# EAGLE design armachat (EAGLE 7.6.0)
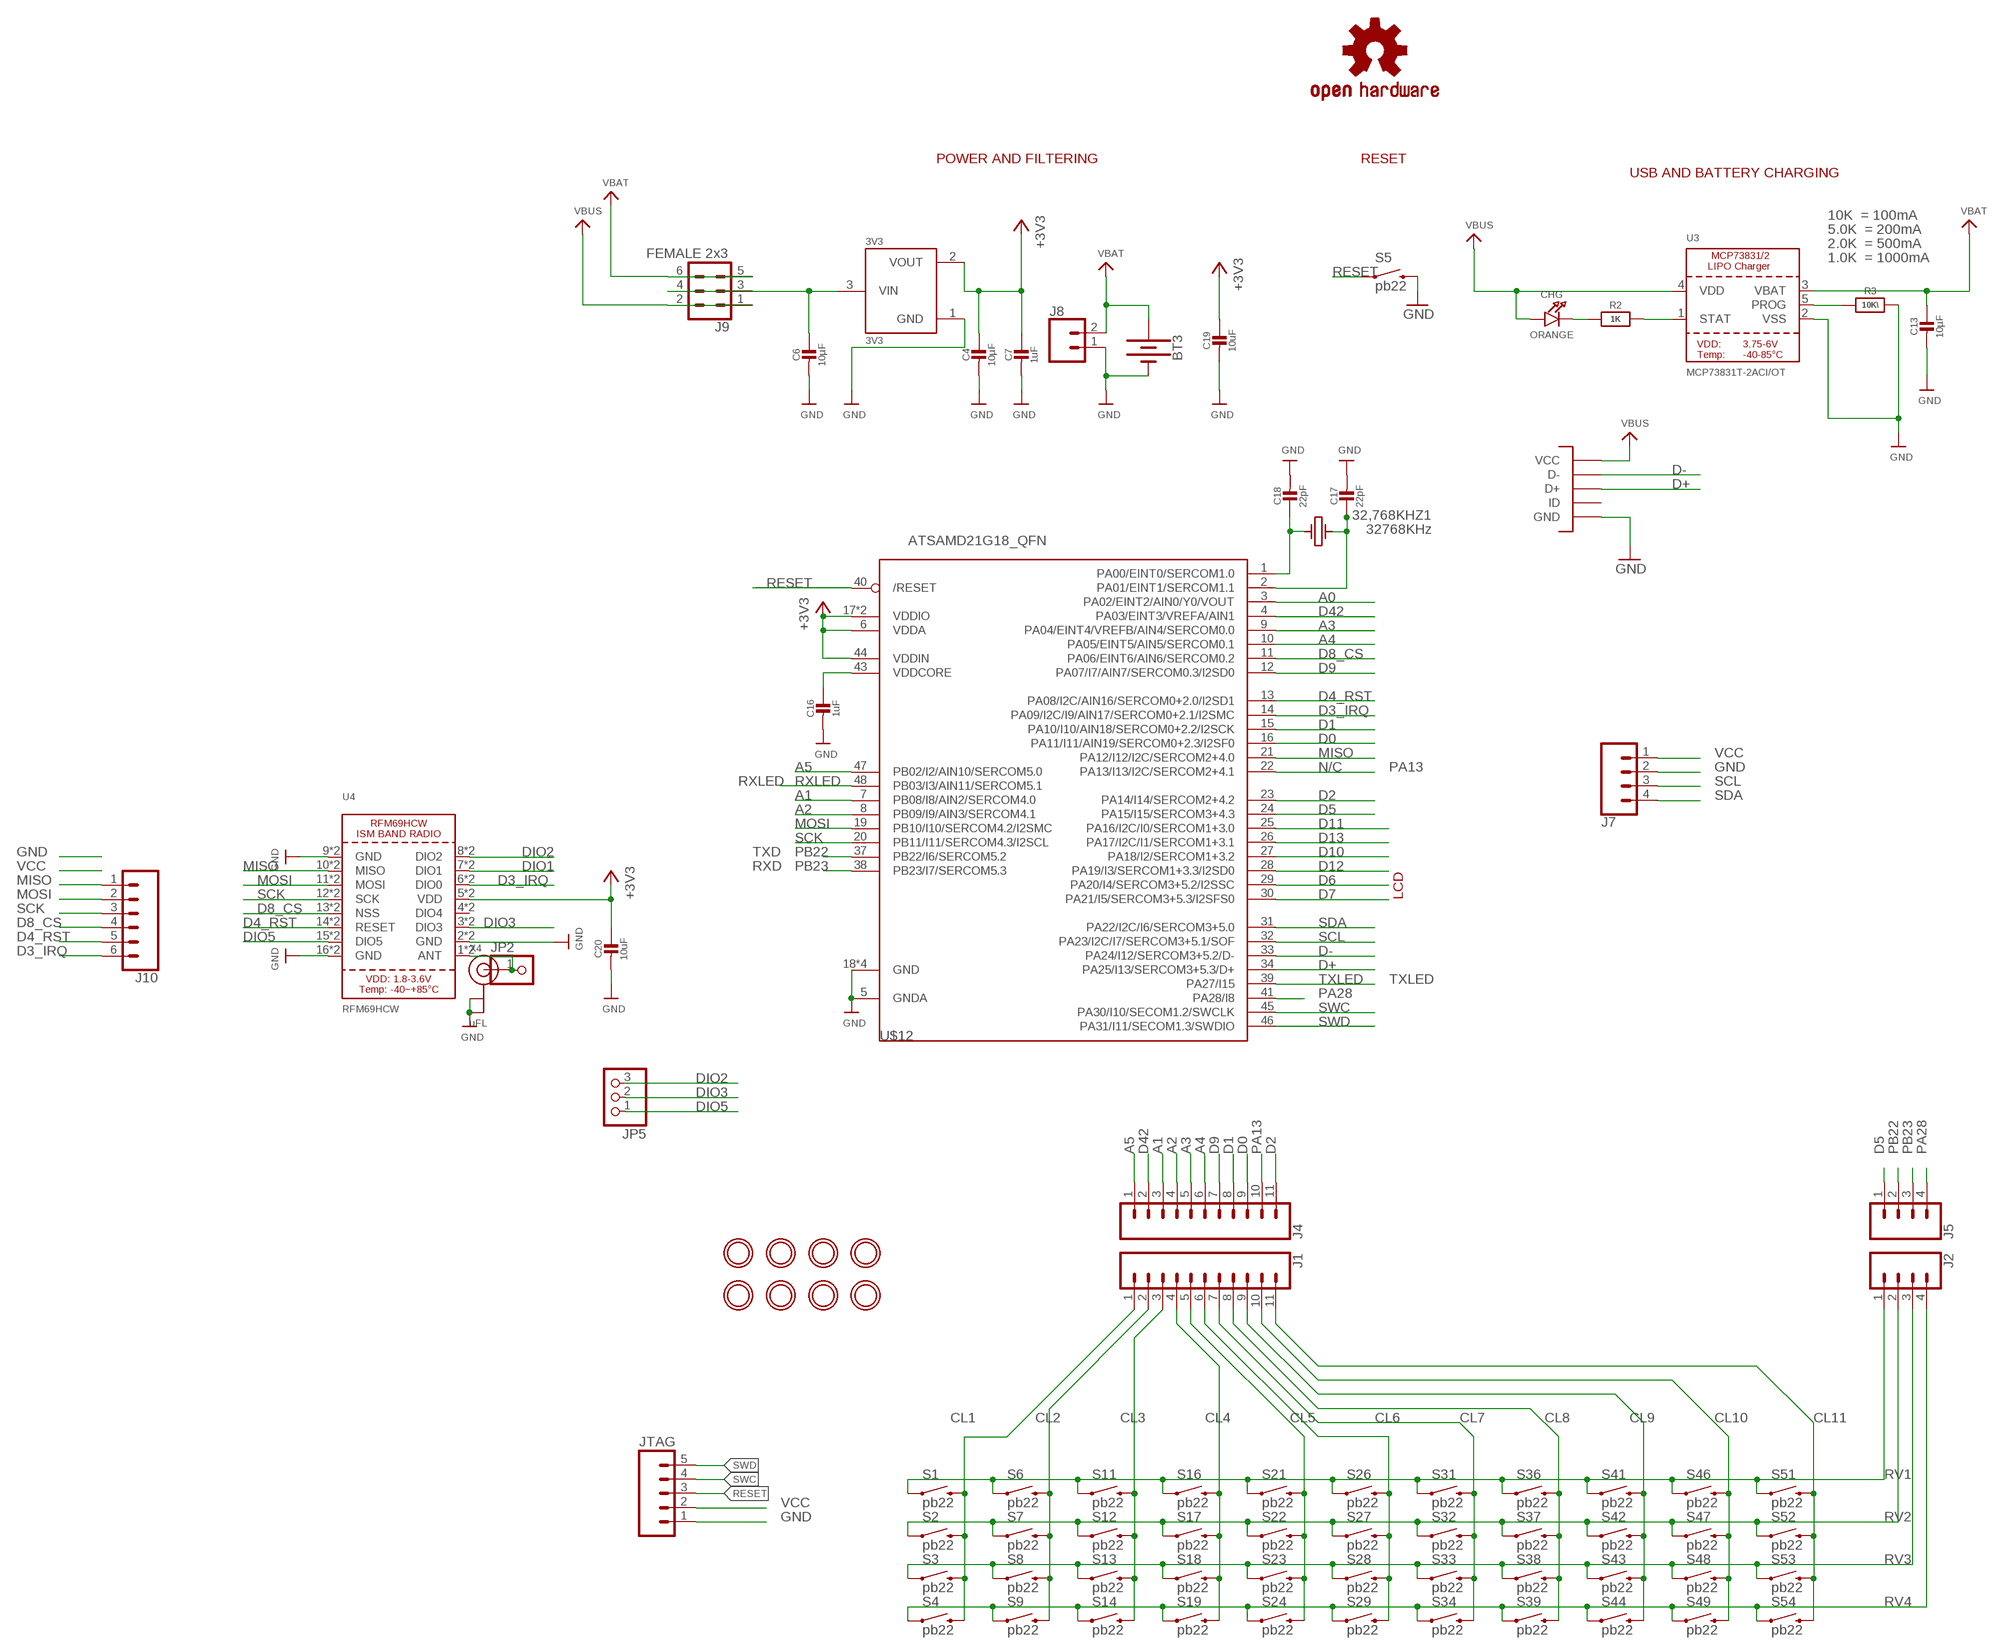
[diagram p0: schematic, sheet 1, part 1 of 2]
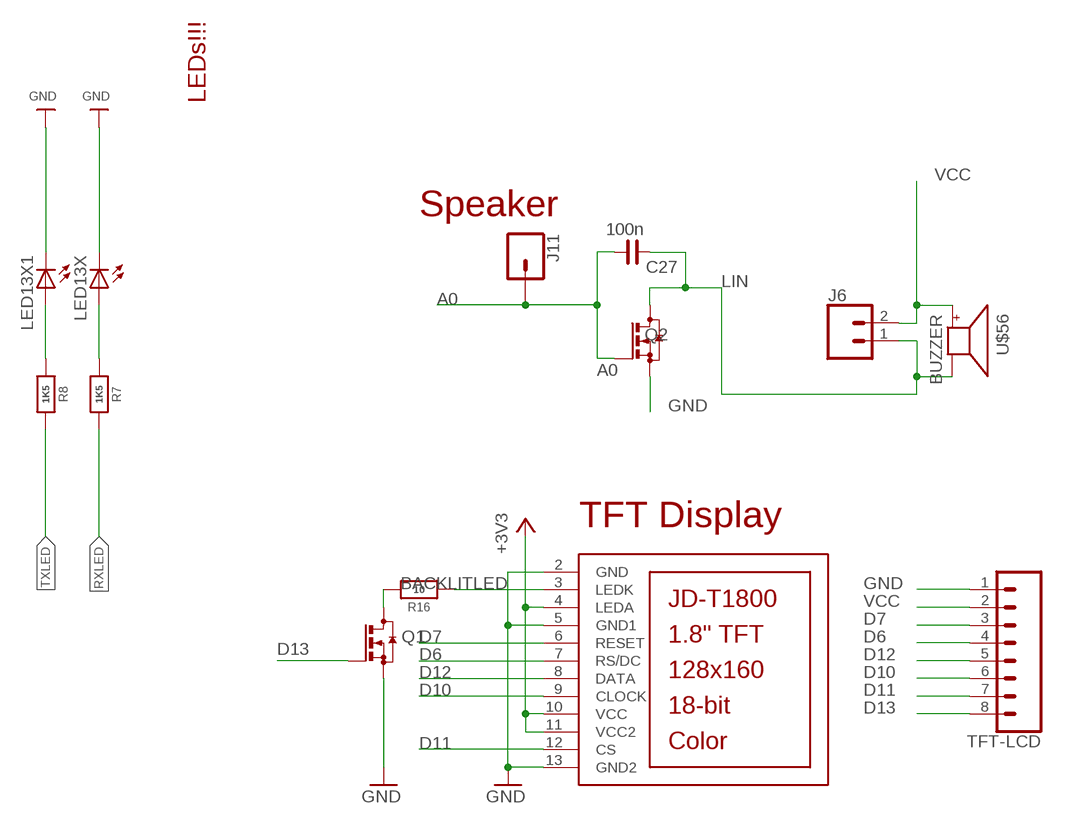
[diagram p1: schematic, sheet 1, part 2 of 2]

## Parts
3V3  3V3  MCP1700T  [SOT23]
32,768KHZ1  32768KHz  CRYSTALL  [KX-327LT]
BT3  BATTERY  [18650_HOLDER_SINGLE_THROUGH-HOLE]
C4  10µF  CAP_CERAMIC0805-NOOUTLINE  [0805-NO]
C6  10µF  CAP_CERAMIC0805-NOOUTLINE  [0805-NO]
C7  1uF  CAP_CERAMIC0603_NO  [0603-NO]
C13  10µF  CAP_CERAMIC0805-NOOUTLINE  [0805-NO]
C16  1uF  CAP_CERAMIC0603_NO  [0603-NO]
C17  22pF  CAP_CERAMIC0603_NO  [0603-NO]
C18  22pF  CAP_CERAMIC0603_NO  [0603-NO]
C19  10uF  CAP_CERAMIC0603_NO  [0603-NO]
C20  10uF  CAP_CERAMIC0805-NOOUTLINE  [0805-NO]
C27  100n  C_0603  [C0603]
CHG  ORANGE  LED0805_NOOUTLINE  [CHIPLED_0805_NOOUTLINE]
J1  CONN_111X11_NO_SILK  [1X11_NO_SILK]
J2  CONN_041X04_NO_SILK  [1X04_NO_SILK]
J4  CONN_111X11_NO_SILK  [1X11_NO_SILK]
J5  CONN_041X04_NO_SILK  [1X04_NO_SILK]
J6  CONN_021X02_NO_SILK  [1X02_NO_SILK]
J7  CONN_041X04_NO_SILK  [1X04_NO_SILK]
J8  CONN_021X02_NO_SILK  [1X02_NO_SILK]
J9  FEMALE 2x3  CONN_03X2FEMALE  [2X3]
J10  CONN_06NO_SILK_FEMALE_PTH  [1X06_NO_SILK]
J11  CONN_01  [1X01]
JP2  HEADER-1X1ROUND  [1X01_ROUND]
JP5  HEADER-1X3ROUND  [1X03_ROUND]
JTAG  M051.27MM  [1X05-1.27MM]
LCD1  DISP_LCD_JDT1800  [JD-T1800]
LED13X  LED3MM  [LED3MM]
LED13X1  LED3MM  [LED3MM]
LOGO3  OSHW-LOGOS  [OSHW-LOGO-S]
Q1  BSS123  [SOT23]
Q2  BSS123  [SOT23]
R2  1K  RESISTOR_0603_NOOUT  [0603-NO]
R3  10K\  RESISTOR_0603_NOOUT  [0603-NO]
R7  1K5  RESISTOR_0603MP  [_0603MP]
R8  1K5  RESISTOR_0603MP  [_0603MP]
R16  10  RESISTOR_0603_NOOUT  [0603-NO]
S1  pb22  SWITCH-MOMENTARY-2PTH  [TACTILE-PTH]
S2  pb22  SWITCH-MOMENTARY-2PTH  [TACTILE-PTH]
S3  pb22  SWITCH-MOMENTARY-2PTH  [TACTILE-PTH]
S4  pb22  SWITCH-MOMENTARY-2PTH  [TACTILE-PTH]
S5  pb22  SWITCH-MOMENTARY-2SMD-1101NE  [TACTILE-SWITCH-1101NE]
S6  pb22  SWITCH-MOMENTARY-2PTH  [TACTILE-PTH]
S7  pb22  SWITCH-MOMENTARY-2PTH  [TACTILE-PTH]
S8  pb22  SWITCH-MOMENTARY-2PTH  [TACTILE-PTH]
S9  pb22  SWITCH-MOMENTARY-2PTH  [TACTILE-PTH]
S11  pb22  SWITCH-MOMENTARY-2PTH  [TACTILE-PTH]
S12  pb22  SWITCH-MOMENTARY-2PTH  [TACTILE-PTH]
S13  pb22  SWITCH-MOMENTARY-2PTH  [TACTILE-PTH]
S14  pb22  SWITCH-MOMENTARY-2PTH  [TACTILE-PTH]
S16  pb22  SWITCH-MOMENTARY-2PTH  [TACTILE-PTH]
S17  pb22  SWITCH-MOMENTARY-2PTH  [TACTILE-PTH]
S18  pb22  SWITCH-MOMENTARY-2PTH  [TACTILE-PTH]
S19  pb22  SWITCH-MOMENTARY-2PTH  [TACTILE-PTH]
S21  pb22  SWITCH-MOMENTARY-2PTH  [TACTILE-PTH]
S22  pb22  SWITCH-MOMENTARY-2PTH  [TACTILE-PTH]
S23  pb22  SWITCH-MOMENTARY-2PTH  [TACTILE-PTH]
S24  pb22  SWITCH-MOMENTARY-2PTH  [TACTILE-PTH]
S26  pb22  SWITCH-MOMENTARY-2PTH  [TACTILE-PTH]
S27  pb22  SWITCH-MOMENTARY-2PTH  [TACTILE-PTH]
S28  pb22  SWITCH-MOMENTARY-2PTH  [TACTILE-PTH]
S29  pb22  SWITCH-MOMENTARY-2PTH  [TACTILE-PTH]
S31  pb22  SWITCH-MOMENTARY-2PTH  [TACTILE-PTH]
S32  pb22  SWITCH-MOMENTARY-2PTH  [TACTILE-PTH]
S33  pb22  SWITCH-MOMENTARY-2PTH  [TACTILE-PTH]
S34  pb22  SWITCH-MOMENTARY-2PTH  [TACTILE-PTH]
S36  pb22  SWITCH-MOMENTARY-2PTH  [TACTILE-PTH]
S37  pb22  SWITCH-MOMENTARY-2PTH  [TACTILE-PTH]
S38  pb22  SWITCH-MOMENTARY-2PTH  [TACTILE-PTH]
S39  pb22  SWITCH-MOMENTARY-2PTH  [TACTILE-PTH]
S41  pb22  SWITCH-MOMENTARY-2PTH  [TACTILE-PTH]
S42  pb22  SWITCH-MOMENTARY-2PTH  [TACTILE-PTH]
S43  pb22  SWITCH-MOMENTARY-2PTH  [TACTILE-PTH]
S44  pb22  SWITCH-MOMENTARY-2PTH  [TACTILE-PTH]
S46  pb22  SWITCH-MOMENTARY-2PTH  [TACTILE-PTH]
S47  pb22  SWITCH-MOMENTARY-2PTH  [TACTILE-PTH]
S48  pb22  SWITCH-MOMENTARY-2PTH  [TACTILE-PTH]
S49  pb22  SWITCH-MOMENTARY-2PTH  [TACTILE-PTH]
S51  pb22  SWITCH-MOMENTARY-2PTH  [TACTILE-PTH]
S52  pb22  SWITCH-MOMENTARY-2PTH  [TACTILE-PTH]
S53  pb22  SWITCH-MOMENTARY-2PTH  [TACTILE-PTH]
S54  pb22  SWITCH-MOMENTARY-2PTH  [TACTILE-PTH]
TFT-LCD  CONN_08"  [1X08]
U3  MCP73831T-2ACI/OT  MCP73831/2  [SOT23-5]
U4  RFM69HCW  [RFM69HCW]
U$2  MOUNTINGHOLE2.0  [MOUNTINGHOLE_2.0_PLATED]
U$3  MOUNTINGHOLE2.0  [MOUNTINGHOLE_2.0_PLATED]
U$4  MOUNTINGHOLE2.0  [MOUNTINGHOLE_2.0_PLATED]
U$5  MICROUSB  [MICRO_B]
U$10  MOUNTINGHOLE2.0  [MOUNTINGHOLE_2.0_PLATED]
U$11  MOUNTINGHOLE2.0  [MOUNTINGHOLE_2.0_PLATED]
U$12  ATSAMD21G18_QFN  ATSAMD21J_QFN  [TQFN48_7MM]
U$19  MOUNTINGHOLE2.0  [MOUNTINGHOLE_2.0_PLATED]
U$20  MOUNTINGHOLE2.0  [MOUNTINGHOLE_2.0_PLATED]
U$42  MOUNTINGHOLE2.0  [MOUNTINGHOLE_2.0_PLATED]
U$56  BUZZER  [SMT-8585-BUZZER]
X4  uFL  ANTENNA_U.FL  [U.FL]

## Nets
A0: C27.1 J11.1 Q2.1(G) U$12.3(PA02/EINT2/AIN0/Y0/VOUT)
A1: J4.3 U$12.7(PB08/I8/AIN2/SERCOM4.0)
A2: J4.4 U$12.8(PB09/I9/AIN3/SERCOM4.1)
A3: J4.5 U$12.9(PA04/EINT4/VREFB/AIN4/SERCOM0.0)
A4: J4.6 U$12.10(PA05/EINT5/AIN5/SERCOM0.1)
A5: J4.1 U$12.47(PB02/I2/AIN10/SERCOM5.0)
ANT: JP2.1 U4.1(ANT) U4.1P(ANT) X4.3(SIGNAL)
BACKLITLED: LCD1.3(LEDK) R16.1
CL1: J1.1 S1.3 S2.3 S3.3 S4.3
CL2: J1.2 S6.3 S7.3 S8.3 S9.3
CL3: J1.3 S11.3 S12.3 S13.3 S14.3
CL4: J1.4 S16.3 S17.3 S18.3 S19.3
CL5: J1.5 S21.3 S22.3 S23.3 S24.3
CL6: J1.6 S26.3 S27.3 S28.3 S29.3
CL7: J1.7 S31.3 S32.3 S33.3 S34.3
CL8: J1.8 S36.3 S37.3 S38.3 S39.3
CL9: J1.9 S41.3 S42.3 S43.3 S44.3
CL10: J1.10 S46.3 S47.3 S48.3 S49.3
CL11: J1.11 S51.3 S52.3 S53.3 S54.3
D0: J4.9 U$12.16(PA11/I11/AIN19/SERCOM0+2.3/I2SF0)
D1: J4.8 U$12.15(PA10/I10/AIN18/SERCOM0+2.2/I2SCK)
D2: J4.11 U$12.23(PA14/I14/SERCOM2+4.2)
D3_IRQ: J10.6 U4.6(DIO0) U4.6P(DIO0) U$12.14(PA09/I2C/I9/AIN17/SERCOM0+2.1/I2SMC)
D4_RST: J10.5 U4.14(RESET) U4.14P(RESET) U$12.13(PA08/I2C/AIN16/SERCOM0+2.0/I2SD1)
D5: J5.1 U$12.24(PA15/I15/SERCOM3+4.3)
D6: LCD1.7(RS/DC) TFT-LCD.4 U$12.29(PA20/I4/SERCOM3+5.2/I2SSC)
D7: LCD1.6(RESET) TFT-LCD.3 U$12.30(PA21/I5/SERCOM3+5.3/I2SFS0)
D8_CS: J10.4 U4.13(NSS) U4.13P(NSS) U$12.11(PA06/EINT6/AIN6/SERCOM0.2)
D9: J4.7 U$12.12(PA07/I7/AIN7/SERCOM0.3/I2SD0)
D10: LCD1.9(CLOCK) TFT-LCD.6 U$12.27(PA18/I2/SERCOM1+3.2)
D11: LCD1.12(CS) TFT-LCD.7 U$12.25(PA16/I2C/I0/SERCOM1+3.0)
D12: LCD1.8(DATA) TFT-LCD.5 U$12.28(PA19/I3/SERCOM1+3.3/I2SD0)
D13: Q1.1(G) TFT-LCD.8 U$12.26(PA17/I2C/I1/SERCOM1+3.1)
D42: J4.2 U$12.4(PA03/EINT3/VREFA/AIN1)
D+: U$5.P3(D+) U$12.34(PA25/I13/SERCOM3+5.3/D+)
D-: U$5.P2(D-) U$12.33(PA24/I12/SERCOM3+5.2/D-)
DIO1: U4.7(DIO1) U4.7P(DIO1)
DIO2: JP5.3 U4.8(DIO2) U4.8P(DIO2)
DIO3: JP5.2 U4.3(DIO3) U4.3P(DIO3)
DIO5: JP5.1 U4.15(DIO5) U4.15P(DIO5)
GND [gnd]: 3V3.1(GND) BT3.CON(-)(-) C4.2 C6.2 C7.2 C13.2 C16.2 C17.2 C18.2 C19.2 C20.2 J7.2 J8.1 JTAG.1 LCD1.2(GND) LCD1.5(GND1) LCD1.13(GND2) LED13X1.K(C) LED13X.K(C) Q1.2(S) Q2.2(S) R3.2 S5.2 TFT-LCD.1 U3.2(VSS) U4.2(GND) U4.2P(GND) U4.9(GND) U4.9P(GND) U4.16(GND) U4.16P(GND) U$5.GND1(GND) U$5.GND2(GND) U$5.GND3(GND) U$5.GND4(GND) U$5.GND7(GND) U$5.GND8(GND) U$5.P5(GND) U$12.5(GNDA) U$12.18(GND) U$12.35(GND) U$12.42(GND) U$12.THERMAL(GND) X4.1(GND) X4.2(GND)
LIN: C27.2 J6.1 Q2.3(D) U$56.-
MISO: J10.1 U4.10(MISO) U4.10P(MISO) U$12.21(PA12/I12/I2C/SERCOM2+4.0)
MOSI: J10.2 U4.11(MOSI) U4.11P(MOSI) U$12.19(PB10/I10/SERCOM4.2/I2SMC)
N$1: 3V3.3(VIN) C6.1 J9.3 J9.4
N$3: CHG.C R2.1
N$5: R2.2 U3.1(STAT)
N$6: R3.1 U3.5(PROG)
N$7: LED13X1.A R8.2
N$8: 32,768KHZ1.4 C17.1 U$12.2(PA01/EINT1/SERCOM1.1)
N$9: 32,768KHZ1.1 C18.1 U$12.1(PA00/EINT0/SERCOM1.0)
N$11: Q1.3(D) R16.2
N$22: LED13X.A R7.2
PA13: J4.10 U$12.22(PA13/I13/I2C/SERCOM2+4.1)
PA28: J5.4 U$12.41(PA28/I8)
PB22: J5.2 U$12.37(PB22/I6/SERCOM5.2)
PB23: J5.3 U$12.38(PB23/I7/SERCOM5.3)
RESET: JTAG.3 S5.1 U$12.40(/RESET)
RV1: J2.1 S1.1 S6.1 S11.1 S16.1 S21.1 S26.1 S31.1 S36.1 S41.1 S46.1 S51.1
RV2: J2.2 S2.1 S7.1 S12.1 S17.1 S22.1 S27.1 S32.1 S37.1 S42.1 S47.1 S52.1
RV3: J2.3 S3.1 S8.1 S13.1 S18.1 S23.1 S28.1 S33.1 S38.1 S43.1 S48.1 S53.1
RV4: J2.4 S4.1 S9.1 S14.1 S19.1 S24.1 S29.1 S34.1 S39.1 S44.1 S49.1 S54.1
RXLED: R7.1 U$12.48(PB03/I3/AIN11/SERCOM5.1)
SCK: J10.3 U4.12(SCK) U4.12P(SCK) U$12.20(PB11/I11/SERCOM4.3/I2SCL)
SCL: J7.3 U$12.32(PA23/I2C/I7/SERCOM3+5.1/SOF)
SDA: J7.4 U$12.31(PA22/I2C/I6/SERCOM3+5.0)
SWC: JTAG.4 U$12.45(PA30/I10/SECOM1.2/SWCLK)
SWD: JTAG.5 U$12.46(PA31/I11/SECOM1.3/SWDIO)
TXLED: R8.1 U$12.39(PA27/I15)
VBAT: BT3.CON(+)(+) C13.1 J8.2 J9.5 J9.6 U3.3(VBAT)
VBUS: CHG.A J9.1 J9.2 U3.4(VDD) U$5.P1(VCC)
VCC [vcc]: 3V3.2(VOUT) C4.1 C7.1 C19.1 C20.1 J6.2 J7.1 JTAG.2 LCD1.4(LEDA) LCD1.10(VCC) LCD1.11(VCC2) TFT-LCD.2 U4.5(VDD) U4.5P(VDD) U$12.6(VDDA) U$12.17(VDDIO) U$12.36(VDDIO) U$12.44(VDDIN) U$56.+ ; supply symbol labelled +3V3
VDDCORE1: C16.1 U$12.43(VDDCORE)
Unconnected: U4.4(DIO4) U4.4P(DIO4) U$5.P4(ID)

## Notes on the sheet
- POWER AND FILTERING | RESET
- USB AND BATTERY CHARGING
- 10K  = 100mA
- 5.0K  = 200mA
- 2.0K  = 500mA
- 1.0K  = 1000mA
- LEDs!!!
- Speaker
- N/C
- RXLED
- TXD
- RXD
- LCD
- TFT Display
- TXLED

## Library data of the parts
3V3 = okie:MCP1700T
32,768KHZ1 = es:CRYSTALL
BT3 = Batteries:BATTERY: Battery - Single Cell A variety of battery chemistries, sizes, and footprints. Device List: 20MM_PTH - Coin Cell Battery Holder - 20mm (PTH) <https://www.sparkfun.com/products/783> 12MM_SMD - Coin Cell Battery Holder - 12mm (SMD) <https://www.sparkfun.com/products/10592> 12MM_PTH - Coin Cell Battery Holder - 12mm (PTH) <https://www.sparkfun.com/products/7948> 20MM_SMD - 20mm Coin Cell Battery Holder (SMD) (2 legs) Used on the Big Time Watch Kit <https://www.sparkfun.com/products/11734> 20MM_SMD_4LEGS - Coin Cell Battery Holder - 20mm (SMD) <https://www.sparkfun.com/products/11892> 20MM_SMD_4LEGS_OVERPASTE - Coin Cell Battery Holder - 20mm (SMD) <https://www.sparkfun.com/products/11892> (Over-paste on the legs) 24.5MM_PTH - Coin Cell Battery Holder - 24.5mm (PTH) <https://www.sparkfun.com/products/8863> 9V - 9V Battery Holder - PC Mount Used on the SparkFun SparkPunk Sound Kit <https://www.sparkfun.com/products/11177> and SparkFun SparkPunk Sequencer Kit <https://www.sparkfun.com/products/12707> 18650 - Battery Holder - 18650 (PTH) <https://www.sparkfun.com/products/13113> AA - Battery Holder - 1xAA (PTH) <https://www.sparkfun.com/products/7949> AAA - Battery Holder - 1xAAA (PTH) <https://www.sparkfun.com/products/12718> AA_KIT - Battery Holder - 1xAA (PTH) <https://www.sparkfun.com/products/7949> Special kit package - pads only have exposed copper on one side of the board. AAA_KIT - Battery Holder - 1xAAA (PTH) <https://www.sparkfun.com/products/12718> Special kit package - pads only have exposed copper on one side of the board.
C4 C6 C7 C13 C16-C20 = microbuilder:CAP_CERAMIC: Ceramic Capacitors For new designs, use the packages preceded by an '_' character since they are more reliable: The following footprints should be used on most boards: _0402 - Standard footprint for regular board layouts _0603 - Standard footprint for regular board layouts _0805 - Standard footprint for regular board layouts _1206 - Standard footprint for regular board layouts For extremely tight-pitch boards where space is at a premium, the following 'micro-pitch' footprints can be used (smaller pads, no silkscreen outline, etc.): _0402MP - Micro-pitch footprint for very dense/compact boards _0603MP - Micro-pitch footprint for very dense/compact boards _0805MP - Micro-pitch footprint for very dense/compact boards _1206MP - Micro-pitch footprint for very dense/compact boards
C27 = rc-master-smd:C_: NON-POLARIZED CAP
CHG = microbuilder:LED: LED
J1 J4 = SparkFun-Connectors:CONN_11: Multi connection point. Often used as Generic Header-pin footprint for 0.1 inch spaced/style header connections On any of the 0.1 inch spaced packages, you can populate with these: Break Away Headers - Straight <https://www.sparkfun.com/products/116> (PRT-00116) Break Away Male Headers - Right Angle <https://www.sparkfun.com/products/553> (PRT-00553) Female Headers <https://www.sparkfun.com/products/115> (PRT-00115) Break Away Headers - Machine Pin <https://www.sparkfun.com/products/117> (PRT-00117) Break Away Female Headers - Swiss Machine Pin <https://www.sparkfun.com/products/743> (PRT-00743) For SCREWTERMINALS and SPRING TERMINALS visit here: Screw Terimnals on SparkFun.com <https://www.sparkfun.com/search/results?term=Screw+Terminals> (5mm/3.5mm/2.54mm spacing) This device is also useful as a general connection point to wire up your design to another part of your project. Our various solder wires solder well into these plated through hole pads. Hook-Up Wire - Assortment (Stranded, 22 AWG) <https://www.sparkfun.com/products/11375> (PRT-11375) Hook-Up Wire - Assortment (Solid Core, 22 AWG) <https://www.sparkfun.com/products/11367> (PRT-11367) View the entire wire category on our website here <https://www.sparkfun.com/categories/141>
J2 J5 J7 = SparkFun-Connectors:CONN_04: Multi connection point. Often used as Generic Header-pin footprint for 0.1 inch spaced/style header connections On any of the 0.1 inch spaced packages, you can populate with these: Break Away Headers - Straight <https://www.sparkfun.com/products/116> (PRT-00116) Break Away Male Headers - Right Angle <https://www.sparkfun.com/products/553> (PRT-00553) Female Headers <https://www.sparkfun.com/products/115> (PRT-00115) Break Away Headers - Machine Pin <https://www.sparkfun.com/products/117> (PRT-00117) Break Away Female Headers - Swiss Machine Pin <https://www.sparkfun.com/products/743> (PRT-00743) For SCREWTERMINALS and SPRING TERMINALS visit here: Screw Terimnals on SparkFun.com <https://www.sparkfun.com/search/results?term=Screw+Terminals> (5mm/3.5mm/2.54mm spacing) This device is also useful as a general connection point to wire up your design to another part of your project. Our various solder wires solder well into these plated through hole pads. Hook-Up Wire - Assortment (Stranded, 22 AWG) <https://www.sparkfun.com/products/11375> (PRT-11375) Hook-Up Wire - Assortment (Solid Core, 22 AWG) <https://www.sparkfun.com/products/11367> (PRT-11367) View the entire wire category on our website here <https://www.sparkfun.com/categories/141> Special notes: Molex polarized connector foot print use with SKU : PRT-08231 with associated crimp pins and housings. 1MM SMD Version SKU: PRT-10208; PROD_ID: CONN-09696
J6 J8 = SparkFun-Connectors:CONN_02: Multi connection point. Often used as Generic Header-pin footprint for 0.1 inch spaced/style header connections On any of the 0.1 inch spaced packages, you can populate with these: Break Away Headers - Straight <https://www.sparkfun.com/products/116> (PRT-00116) Break Away Male Headers - Right Angle <https://www.sparkfun.com/products/553> (PRT-00553) Female Headers <https://www.sparkfun.com/products/115> (PRT-00115) Break Away Headers - Machine Pin <https://www.sparkfun.com/products/117> (PRT-00117) Break Away Female Headers - Swiss Machine Pin <https://www.sparkfun.com/products/743> (PRT-00743) For SCREWTERMINALS and SPRING TERMINALS visit here: Screw Terimnals on SparkFun.com <https://www.sparkfun.com/search/results?term=Screw+Terminals> (5mm/3.5mm/2.54mm spacing) This device is also useful as a general connection point to wire up your design to another part of your project. Our various solder wires solder well into these plated through hole pads. Hook-Up Wire - Assortment (Stranded, 22 AWG) <https://www.sparkfun.com/products/11375> (PRT-11375) Hook-Up Wire - Assortment (Solid Core, 22 AWG) <https://www.sparkfun.com/products/11367> (PRT-11367) View the entire wire category on our website here <https://www.sparkfun.com/categories/141> Special notes: Molex polarized connector foot print use with: PRT-08233 with associated crimp pins and housings. 2.54_SCREWTERM for use with PRT-10571. 3.5mm Screw Terminal footprints for PRT-08084 5mm Screw Terminal footprints for use with PRT-08432
J9 = SparkFun-Connectors:CONN_03X2: Multi connection point. Often used as Generic Header-pin footprint for 0.1 inch spaced/style header connections You can populate with any combo of single row headers, but if you'd like an exact match, check these: Header - 2x3 (Male, 0.1") <https://www.sparkfun.com/products/12807> (PRT-12807) Header - 2x3 (Female, 0.1") <https://www.sparkfun.com/products/13010> (PRT-13010) 2x3 Pin Shrouded Header <https://www.sparkfun.com/products/10877> (PRT-10877) On any of the 0.1 inch spaced packages, you can populate with these: Break Away Headers - Straight <https://www.sparkfun.com/products/116> (PRT-00116) Break Away Male Headers - Right Angle <https://www.sparkfun.com/products/553> (PRT-00553) Female Headers <https://www.sparkfun.com/products/115> (PRT-00115) Break Away Headers - Machine Pin <https://www.sparkfun.com/products/117> (PRT-00117) Break Away Female Headers - Swiss Machine Pin <https://www.sparkfun.com/products/743> (PRT-00743) Special note: the shrouded connector mates well with our 3x2 ribbon cables: Ribbon Crimp Connector - 6-pin (2x3, Female) <https://www.sparkfun.com/products/10651> (PRT-10651) Ribbon Cable - 6 wire (15ft) <https://www.sparkfun.com/products/10646> (PRT-10646); PROD_ID: CONN-11566
J10 = SparkFun-Connectors:CONN_06: Multi connection point. Often used as Generic Header-pin footprint for 0.1 inch spaced/style header connections On any of the 0.1 inch spaced packages, you can populate with these: Break Away Headers - Straight <https://www.sparkfun.com/products/116> (PRT-00116) Break Away Male Headers - Right Angle <https://www.sparkfun.com/products/553> (PRT-00553) Female Headers <https://www.sparkfun.com/products/115> (PRT-00115) Break Away Headers - Machine Pin <https://www.sparkfun.com/products/117> (PRT-00117) Break Away Female Headers - Swiss Machine Pin <https://www.sparkfun.com/products/743> (PRT-00743) Arduino Stackable Header - 6 Pin <https://www.sparkfun.com/products/9280> (PRT-09280) For SCREWTERMINALS and SPRING TERMINALS visit here: Screw Terimnals on SparkFun.com <https://www.sparkfun.com/search/results?term=Screw+Terminals> (5mm/3.5mm/2.54mm spacing) This device is also useful as a general connection point to wire up your design to another part of your project. Our various solder wires solder well into these plated through hole pads. Hook-Up Wire - Assortment (Stranded, 22 AWG) <https://www.sparkfun.com/products/11375> (PRT-11375) Hook-Up Wire - Assortment (Solid Core, 22 AWG) <https://www.sparkfun.com/products/11367> (PRT-11367) View the entire wire category on our website here <https://www.sparkfun.com/categories/141>; PROD_ID: CONN-08437
J11 = SparkFun-Connectors:CONN_01: Single connection point. Often used as Generic Header-pin footprint for 0.1 inch spaced/style header connections On any of the 0.1 inch spaced packages, you can populate with these: Break Away Headers - Straight <https://www.sparkfun.com/products/116> (PRT-00116) Break Away Male Headers - Right Angle <https://www.sparkfun.com/products/553> (PRT-00553) Female Headers <https://www.sparkfun.com/products/115> (PRT-00115) Break Away Headers - Machine Pin <https://www.sparkfun.com/products/117> (PRT-00117) Break Away Female Headers - Swiss Machine Pin <https://www.sparkfun.com/products/743> (PRT-00743) This device is also useful as a general connection point to wire up your design to another part of your project. Our various solder wires solder well into these plated through hole pads. Hook-Up Wire - Assortment (Stranded, 22 AWG) <https://www.sparkfun.com/products/11375> (PRT-11375) Hook-Up Wire - Assortment (Solid Core, 22 AWG) <https://www.sparkfun.com/products/11367> (PRT-11367) View the entire wire category on our website here <https://www.sparkfun.com/categories/141> Special notes: SMTSO-256-ET is a "flush mount" nut for a 4-40 screw. We mostly use this on specialty testbeds; it is a nice way to connect hardware to your PCB at an adjustable hieght. Also note, the SNAP packages are for using a snappable style connector. We sell a baggie of snaps and they are also used on two LilyPad designs: Snap Assortment - 30 pack (male and female) <https://www.sparkfun.com/products/11347> (DEV-11347) LilyPad Arduino SimpleSnap <https://www.sparkfun.com/products/10941> (DEV-10941) LilyPad SimpleSnap Protoboard <https://www.sparkfun.com/products/10940> (DEV-10940)
JP2 = microbuilder:HEADER-1X1: PIN HEADER
JP5 = microbuilder:HEADER-1X3: PIN HEADER
JTAG = SparkFun-Connectors:M05: Header 5 Standard 5-pin 0.1" header. Use with straight break away headers (SKU : PRT-00116), right angle break away headers (PRT-00553), swiss pins (PRT-00743), machine pins (PRT-00117), and female headers (PRT-00115). Molex polarized connector foot print use with SKU : PRT-08230 with associated crimp pins and housings.
LCD1 = microbuilder:DISP_LCD_JDT1800
LED13X LED13X1 = led:LED: LED
LOGO3 = SparkFun-Aesthetics:OSHW-LOGO: Open Source Hardware Logo This logo indicates the piece of hardware it is found on incorporates a OSHW license and/or adheres to the definition of open source hardware found here: http://freedomdefined.org/OSHW
Q1 Q2 = transistor-small-signal:BSS123: N-CHANNEL MOS FET
R2 R3 R7 R8 R16 = microbuilder:RESISTOR: Resistors For new designs, use the packages preceded by an '_' character since they are more reliable: The following footprints should be used on most boards: _0402 - Standard footprint for regular board layouts _0603 - Standard footprint for regular board layouts _0805 - Standard footprint for regular board layouts _1206 - Standard footprint for regular board layouts For extremely tight-pitch boards where space is at a premium, the following 'micro-pitch' footprints can be used (smaller pads, no silkscreen outline, etc.): _0402MP - Micro-pitch footprint for very dense/compact boards _0603MP - Micro-pitch footprint for very dense/compact boards _0805MP - Micro-pitch footprint for very dense/compact boards _1206MP - Micro-pitch footprint for very dense/compact boards
S1-S4 S6-S9 S11-S14 S16-S19 S21-S24 S26-S29 S31-S34 S36-S39 S41-S44 S46-S49 S51-S54 = SparkFun-Electromechanical:SWITCH-MOMENTARY-2: Various NO switches- pushbuttons, reed, etc; PROD_ID: SWCH-08441
S5 = SparkFun-Electromechanical:SWITCH-MOMENTARY-2: Various NO switches- pushbuttons, reed, etc; PROD_ID: SWCH-00815
TFT-LCD = SparkFun-Connectors:CONN_08: Multi connection point. Often used as Generic Header-pin footprint for 0.1 inch spaced/style header connections On any of the 0.1 inch spaced packages, you can populate with these: Break Away Headers - Straight <https://www.sparkfun.com/products/116> (PRT-00116) Break Away Male Headers - Right Angle <https://www.sparkfun.com/products/553> (PRT-00553) Female Headers <https://www.sparkfun.com/products/115> (PRT-00115) Break Away Headers - Machine Pin <https://www.sparkfun.com/products/117> (PRT-00117) Break Away Female Headers - Swiss Machine Pin <https://www.sparkfun.com/products/743> (PRT-00743) Arduino Stackable Header - 8 Pin <https://www.sparkfun.com/products/9279> (PRT-09279) For SCREWTERMINALS and SPRING TERMINALS visit here: Screw Terimnals on SparkFun.com <https://www.sparkfun.com/search/results?term=Screw+Terminals> (5mm/3.5mm/2.54mm spacing) This device is also useful as a general connection point to wire up your design to another part of your project. Our various solder wires solder well into these plated through hole pads. Hook-Up Wire - Assortment (Stranded, 22 AWG) <https://www.sparkfun.com/products/11375> (PRT-11375) Hook-Up Wire - Assortment (Solid Core, 22 AWG) <https://www.sparkfun.com/products/11367> (PRT-11367) View the entire wire category on our website here <https://www.sparkfun.com/categories/141> Special notes: Molex polarized connector foot print use with SKU : PRT-08231 with associated crimp pins and housings. 1MM SMD Version SKU: PRT-10208 NOTES ON THE VARIANTS LOCK and LOCK_LONGPADS... This footprint was designed to help hold the alignment of a through-hole component (i.e. 6-pin header) while soldering it into place. You may notice that each hole has been shifted either up or down by 0.005 of an inch from it's more standard position (which is a perfectly straight line). This slight alteration caused the pins (the squares in the middle) to touch the edges of the holes. Because they are alternating, it causes a "brace" to hold the component in place. 0.005 has proven to be the perfect amount of "off-center" position when using our standard breakaway headers. Although looks a little odd when you look at the bare footprint, once you have a header in there, the alteration is very hard to notice. Also,if you push a header all the way into place, it is covered up entirely on the bottom side.; PROD_ID: CONN-08438
U3 = microbuilder:MCP73831/2: MCP73831/2 LIPO Charger VDD: 3.75 - 6V Temp -40 - 85°C Programmable Charge Rate: 15-500mA NOTE: STAT is a tri-state logic output on the MCP73831 and an open-drain output on the MCP73832. SOT23-5 with 4.2V output and tri-state logic on STAT = MCP73831T-2ACI/OT
U4 = microbuilder:RFM69HCW: RFM69HCW - ISM Band RF Transceiver
U$2-U$4 U$10 U$11 U$19 U$20 U$42 = microbuilder:MOUNTINGHOLE: Mounting Hole For #2 screws (0.086"/2.18mm width, 0.094"/2.4mm hole) use 2.5mm; BOM: EXCLUDE
U$5 = Other:MICROUSB
U$12 = microbuilder:ATSAMD21J
U$56 = adafruit:BUZZER
X4 = microbuilder:ANTENNA_U.FL: U.FL Antenna Connector

## Net classes
0 default: width 0.203 mm, drill 0.356 mm, clearance 0.203 mm
1 gnd: width 0.203 mm, drill 0.356 mm, clearance 0.203 mm
2 vcc: width 0.203 mm, drill 0.356 mm, clearance 0.203 mm

## Board
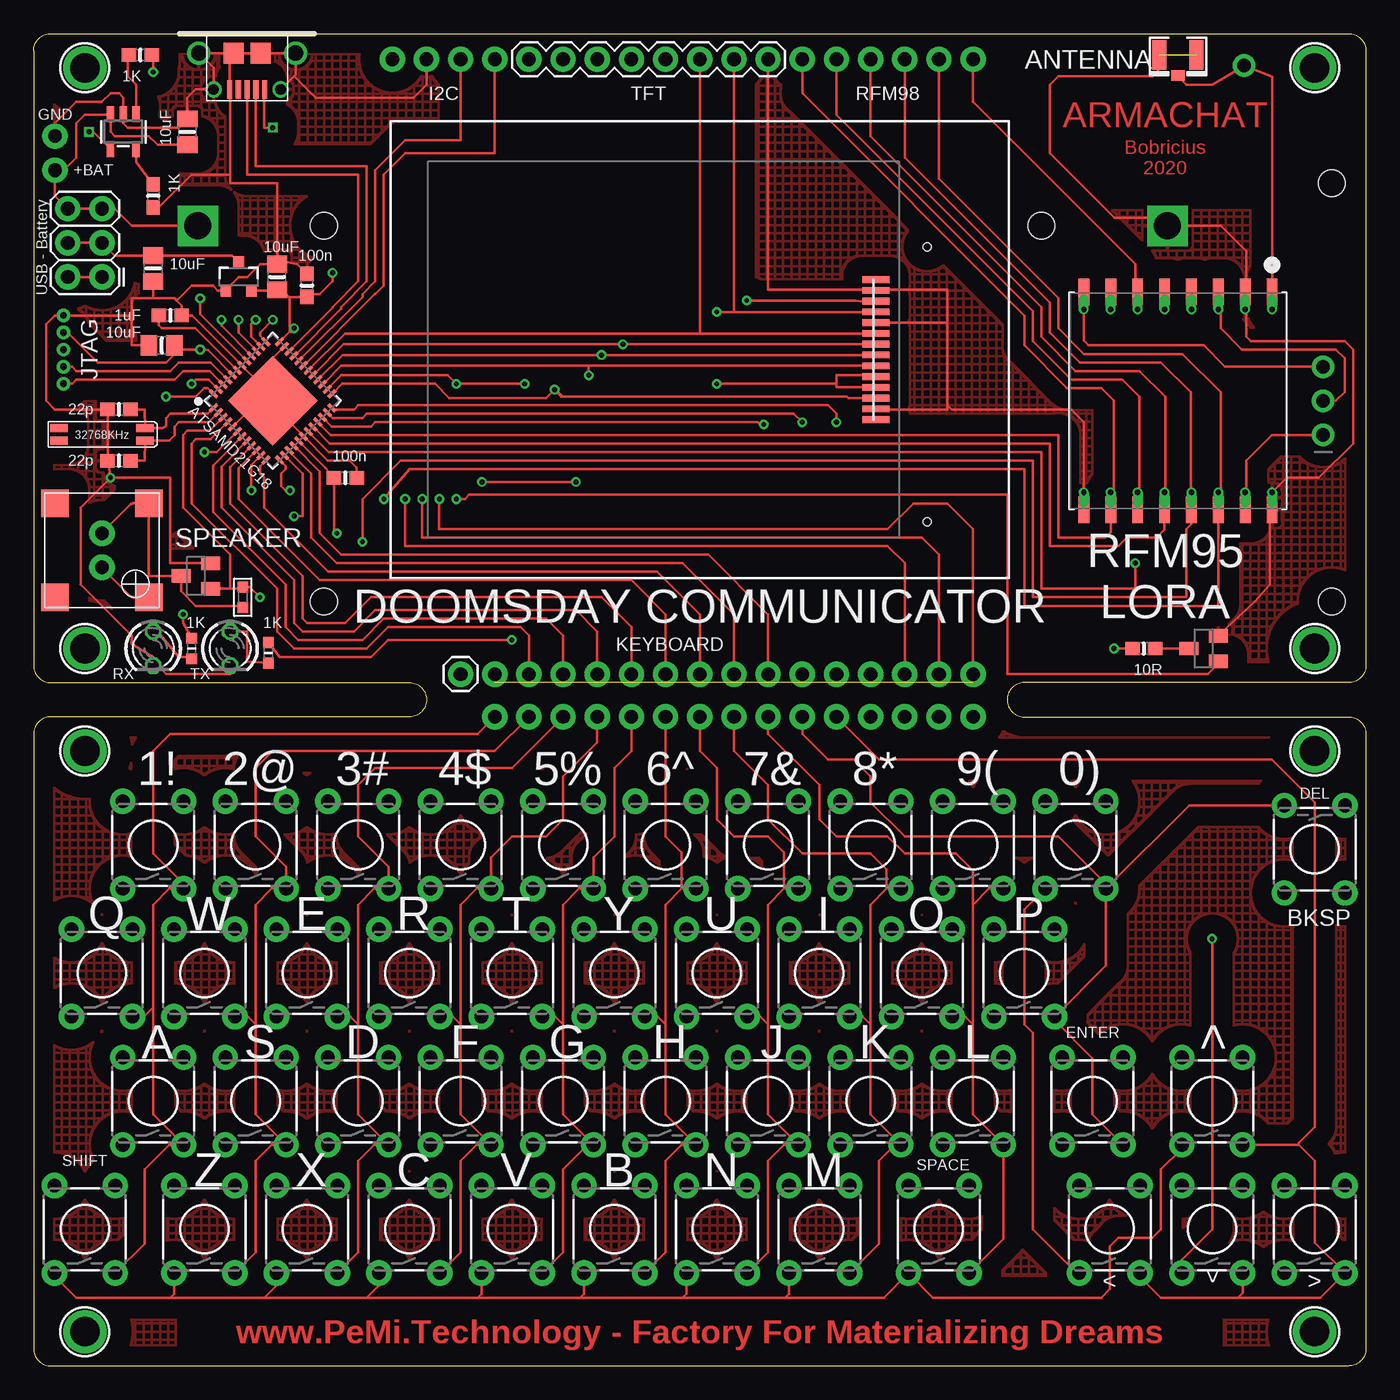
[diagram p2: board, top side]
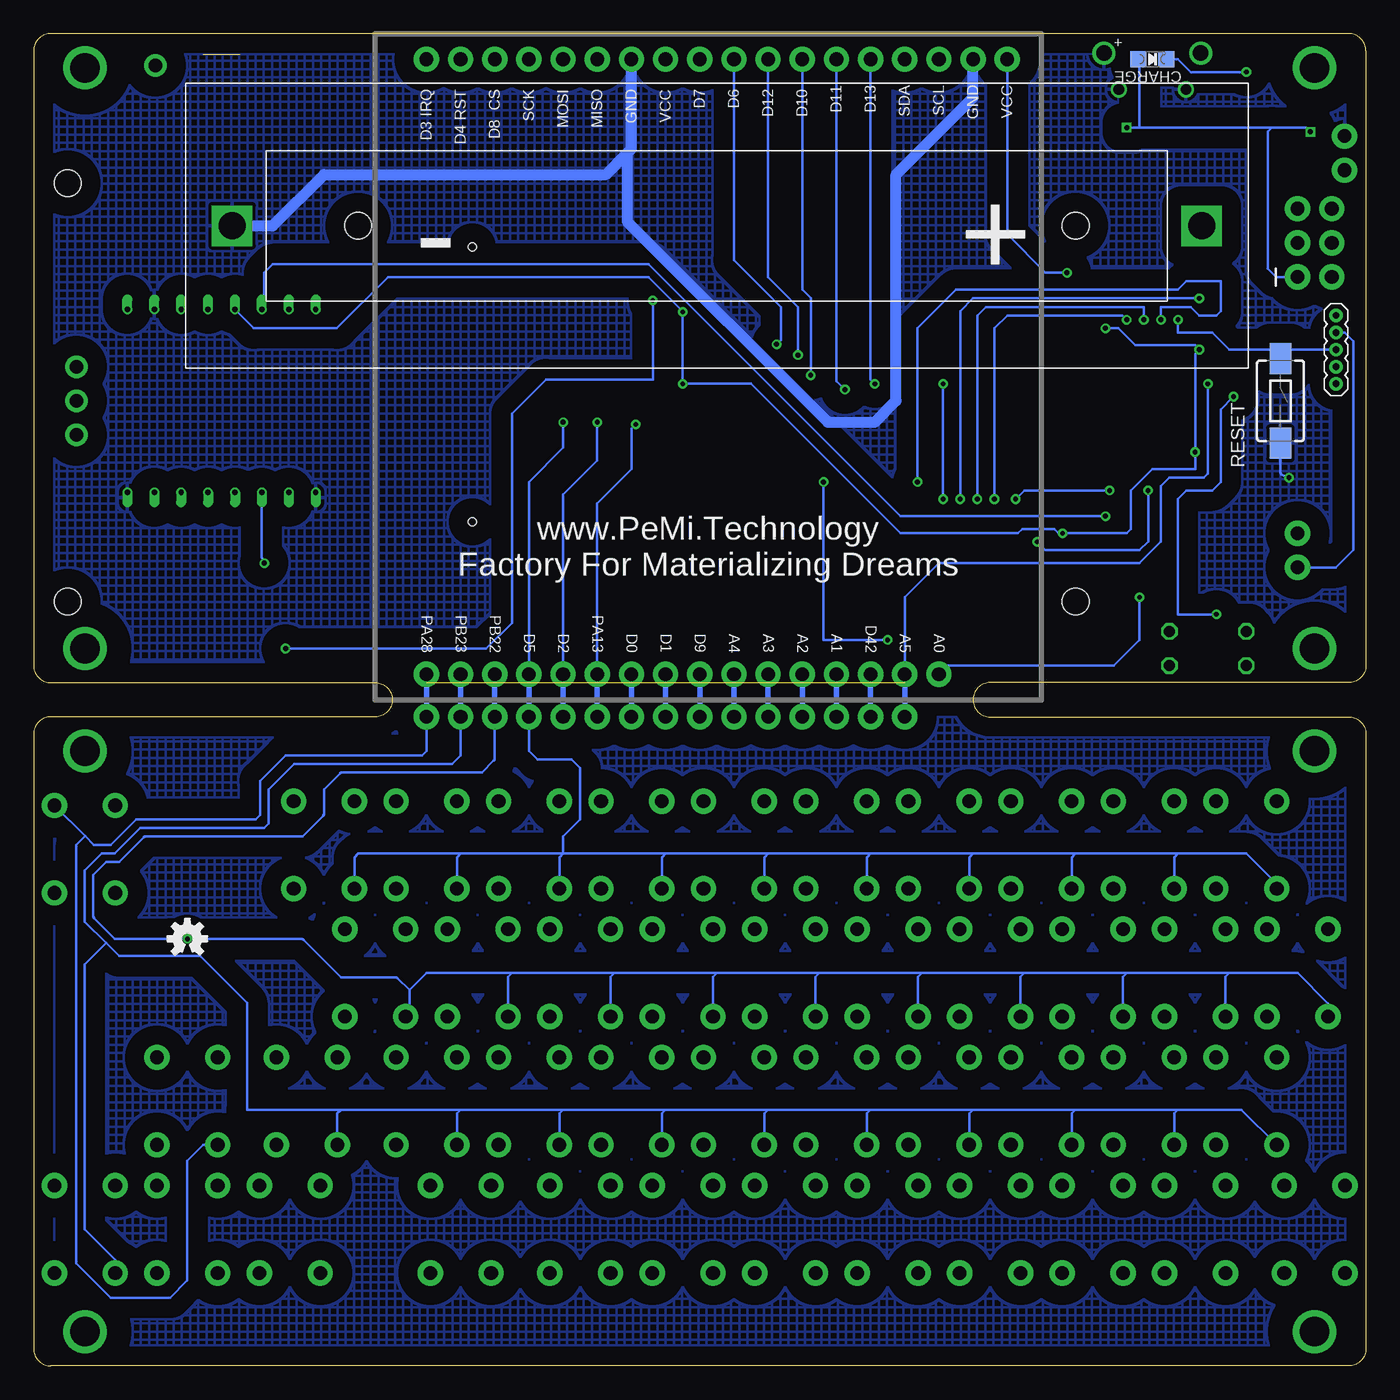
[diagram p3: board, bottom side, seen from below]

Size 99.06 x 99.06 mm. Coordinates in mm from the lower left corner, seen from the top.
Outline: 0,97.79 0,52.07 arc90 1.27,50.8 27.94,50.8 arc-180 27.94,48.26 1.27,48.26 arc90 0,46.99 0,1.27 arc90 1.27,0 97.79,0 arc90 99.06,1.27 99.06,46.99 arc90 97.79,48.26 73.66,48.26 arc-180 73.66,50.8 97.79,50.8 arc90 99.06,52.07 99.06,97.79 arc90 97.79,99.06 1.27,99.06 arc90 0,97.79
Copper layers (1*16): Top 0.0356mm / dielectric 1.5011mm / Bottom 0.0356mm
Design rules "LaenPCBOrder *": minimum track width 6mil, minimum drill 13mil, track to track 6mil, track to pad 6mil, pad to pad 6mil, via to via 6mil, smd to smd 6mil, copper to edge 15mil, drill to drill 6mil, minimum pad ring 7mil, minimum via ring 7mil, stop-mask expansion 4mil, vias tented up to drill 30mil, thermal gap 10mil
Holes 2 mm at 96.52,87.95 96.52,56.83 21.59,56.83
tRestrict: area 76.2,87.6 to 91.4,94.6

### Footprints (pad centres in the part's own frame; a part is rotated, then mirrored left to right if it is on the bottom)
SOT23 = smd 0.8 x 0.9: 1 -0.95,-1; 2 0.95,-1; 3 0,1.1
KX-327LT = smd 1.3 x 0.6: 1 -3.2,-0.5; 2 3.2,-0.5; 3 3.2,0.4; 4 -3.2,0.4
18650_HOLDER_SINGLE_THROUGH-HOLE = drill 2 square: CON(+) -36.05,0; CON(-) 36.05,0 | hole 2: 26.67,0; -26.67,0
0805-NO = smd 1.24 x 1.5: 1 -0.95,0; 2 0.95,0
0603-NO = smd 1.075 x 1: 1 -0.85,0; 2 0.85,0
C0603 = smd 0.8 x 0.8: 1 -0.762,0; 2 0.762,0
CHIPLED_0805_NOOUTLINE = smd 1.2 x 1.2: A 0,-1.05; C 0,1.05
1X11_NO_SILK = drill 1.016 pad 1.88: 1 0,0; 2 2.54,0; 3 5.08,0; 4 7.62,0; 5 10.16,0; 6 12.7,0; 7 15.24,0; 8 17.78,0; 9 20.32,0; 10 22.86,0; 11 25.4,0
1X04_NO_SILK = drill 1.016 pad 1.88: 1 0,0; 2 2.54,0; 3 5.08,0; 4 7.62,0
1X02_NO_SILK = drill 1.016 pad 1.88: 1 0,0; 2 2.54,0
2X3 = drill 1.016 pad 1.88: 1 0,0; 2 0,2.54; 3 2.54,0; 4 2.54,2.54; 5 5.08,0; 6 5.08,2.54
1X06_NO_SILK = drill 1.016 pad 1.88: 1 0,0; 2 2.54,0; 3 5.08,0; 4 7.62,0; 5 10.16,0; 6 12.7,0
1X01 = drill 1.016 pad 1.88: 1 0,0
1X01_ROUND = drill 1 pad 1.676: 1 0,0
1X03_ROUND = drill 1 pad 1.676: 1 -2.54,0; 2 0,0; 3 2.54,0
1X05-1.27MM = drill 0.508 pad 1: 1 0,0; 2 1.27,0; 3 2.54,0; 4 3.81,0; 5 5.08,0
JD-T1800 = smd 0.5 x 2: 1 5.2,-13.1; 2 4.4,-13.1; 3 3.6,-13.1; 4 2.8,-13.1; 5 2,-13.1; 6 1.2,-13.1; 7 0.4,-13.1; 8 -0.4,-13.1; 9 -1.2,-13.1; 10 -2,-13.1; 11 -2.8,-13.1; 12 -3.6,-13.1; 13 -4.4,-13.1; 14 -5.2,-13.1 | hole 0.6: -12.8,-16.9; 7.65,-16.9
LED3MM = drill 0.813 octagon: A -1.27,0; K 1.27,0
SOT23' = smd 1 x 1.4: 1 -0.95,-1.1; 2 0.95,-1.1; 3 0,1.1
_0603MP = smd 0.8 x 0.8: 1 -0.762,0; 2 0.762,0
TACTILE-PTH = drill 1.016 pad 1.88: 1 -3.251,2.261; 2 3.251,2.261; 3 -3.251,-2.261; 4 3.251,-2.261
TACTILE-SWITCH-1101NE = smd 2.3 x 1.6: 1 -3.15,0; 2 3.15,0
1X08 = drill 1.016 pad 1.88: 1 0,0; 2 2.54,0; 3 5.08,0; 4 7.62,0; 5 10.16,0; 6 12.7,0; 7 15.24,0; 8 17.78,0
SOT23-5 = smd 0.55 x 1.2: 1 -0.95,-1.3; 2 0,-1.3; 3 0.95,-1.3; 4 0.95,1.3; 5 -0.95,1.3
RFM69HCW = drill 0.4 offset: 1 6.8,-7; 2 6.8,-5; 3 6.8,-3; 4 6.8,-1; 5 6.8,1; 6 6.8,3; 7 6.8,5; 8 6.8,7; 9 -6.8,7; 10 -6.8,5; 11 -6.8,3; 12 -6.8,1; 13 -6.8,-1; 14 -6.8,-3; 15 -6.8,-5; 16 -6.8,-7 | smd 2 x 0.8: 1P 8.1,-7; 2P 8.1,-5; 3P 8.1,-3; 4P 8.1,-1; 5P 8.1,1; 6P 8.1,3; 7P 8.1,5; 8P 8.1,7; 9P -8.1,7; 10P -8.1,5; 11P -8.1,3; 12P -8.1,1; 13P -8.1,-1; 14P -8.1,-3; 15P -8.1,-5; 16P -8.1,-7
MOUNTINGHOLE_2.0_PLATED = drill 2.2 pad 3: P$1 0,0
MICRO_B = smd 1.5 x 1.55: GND1 -1,1.45; GND2 1,1.45 | drill 0.8: GND3 -2.5,4.15; GND4 2.5,4.15 | drill 1.15: GND7 -3.598,1.45; GND8 3.598,1.45 | smd 0.4 x 1.35: P1 -1.3,4.15; P2 -0.65,4.15; P3 0,4.15; P4 0.65,4.15; P5 1.3,4.15
TQFN48_7MM = smd 0.25 x 0.75: 1 -2.75,-3.475; 2 -2.25,-3.475; 3 -1.75,-3.475; 4 -1.25,-3.475; 5 -0.75,-3.475; 6 -0.25,-3.475; 7 0.25,-3.475; 8 0.75,-3.475; 9 1.25,-3.475; 10 1.75,-3.475; 11 2.25,-3.475; 12 2.75,-3.475; 25 2.75,3.475; 26 2.25,3.475; 27 1.75,3.475; 28 1.25,3.475; 29 0.75,3.475; 30 0.25,3.475; 31 -0.25,3.475; 32 -0.75,3.475; 33 -1.25,3.475; 34 -1.75,3.475; 35 -2.25,3.475; 36 -2.75,3.475 | smd 0.75 x 0.25: 13 3.475,-2.75; 14 3.475,-2.25; 15 3.475,-1.75; 16 3.475,-1.25; 17 3.475,-0.75; 18 3.475,-0.25; 19 3.475,0.25; 20 3.475,0.75; 21 3.475,1.25; 22 3.475,1.75; 23 3.475,2.25; 24 3.475,2.75; 37 -3.475,2.75; 38 -3.475,2.25; 39 -3.475,1.75; 40 -3.475,1.25; 41 -3.475,0.75; 42 -3.475,0.25; 43 -3.475,-0.25; 44 -3.475,-0.75; 45 -3.475,-1.25; 46 -3.475,-1.75; 47 -3.475,-2.25; 48 -3.475,-2.75 | smd 4.7 x 4.7: THERMAL 0,0
SMT-8585-BUZZER = smd 2.05 x 2.05: + -3.5,-3.5; - 3.5,-3.5; NC1 -3.5,3.5; NC2 3.5,3.5
U.FL = smd 2.2 x 1.05: 1 0,1.375; 2 0,-1.375 | smd 0.8 x 1: 3 1.525,0

### Placement (x,y rotation side)
3V3  15.24,80.96 0 top
32,768KHZ1  5.08,69.22 180 top
BT3  48.26,84.77 180 bottom
C4  18.1,80.96 90 top
C6  8.89,81.6 270 top
C7  20.32,80.33 90 top
C13  11.43,91.76 90 top
C16  10.16,78.11 0 top
C17  6.35,67.31 180 top
C18  6.35,71.12 180 top
C19  23.18,66.04 0 top
C20  9.52,75.88 180 top
C27  15.56,57.15 270 top
CHG  15.88,97.16 270 bottom
J1  34.29,48.26 0 top
J2  62.23,48.26 0 top
J4  34.29,51.44 0 top
J5  62.23,51.44 0 top
J6  5.08,61.91 270 top
J7  26.67,97.16 0 top
J8  1.59,91.44 270 top
J9  5.08,80.96 90 top
J10  57.15,97.16 0 top
J11  31.75,51.44 0 top
JP2  90.01,96.68 0 top
JP5  95.88,71.75 90 top
JTAG  2.22,78.11 270 bottom
LCD1  49.53,75.56 90 top
LED13X  8.89,53.34 270 top
LED13X1  14.6,53.34 270 top
LOGO3  87.63,31.75 0 bottom
Q1  BSS123  [SOT23']  87,53.34 90 top
Q2  BSS123  [SOT23']  12.06,58.74 90 top
R2  7.94,97.47 180 top
R3  8.89,87 270 top
R7  11.75,53.34 270 top
R8  17.46,53.02 270 top
R16  82.55,53.34 0 top
S1  8.89,38.73 90 top
S2  5.08,29.21 90 top
S3  8.89,19.69 90 top
S4  3.81,10.16 90 top
S5  6.35,71.75 270 bottom
S6  16.51,38.73 90 top
S7  12.7,29.21 90 top
S8  16.51,19.69 90 top
S9  12.7,10.16 90 top
S11  24.13,38.73 90 top
S12  20.32,29.21 90 top
S13  24.13,19.69 90 top
S14  20.32,10.16 90 top
S16  31.75,38.73 90 top
S17  27.94,29.21 90 top
S18  31.75,19.69 90 top
S19  27.94,10.16 90 top
S21  39.37,38.73 90 top
S22  35.56,29.21 90 top
S23  39.37,19.69 90 top
S24  35.56,10.16 90 top
S26  46.99,38.73 90 top
S27  43.18,29.21 90 top
S28  46.99,19.69 90 top
S29  43.18,10.16 90 top
S31  54.61,38.73 90 top
S32  50.8,29.21 90 top
S33  54.61,19.69 90 top
S34  50.8,10.16 90 top
S36  62.23,38.73 90 top
S37  58.42,29.21 90 top
S38  62.23,19.69 90 top
S39  58.42,10.16 90 top
S41  69.85,38.73 90 top
S42  66.04,29.21 90 top
S43  69.85,19.69 90 top
S44  67.31,10.16 90 top
S46  77.47,38.73 90 top
S47  73.66,29.21 90 top
S48  78.74,19.69 90 top
S49  95.25,38.42 270 top
S51  80.01,10.16 90 top
S52  87.63,10.16 90 top
S53  95.25,10.16 90 top
S54  87.63,19.69 90 top
TFT-LCD  54.61,97.16 180 top
U3  6.67,91.76 180 top
U4  85.09,71.75 90 top
U$2  3.81,2.54 0 top
U$3  3.81,96.52 0 top
U$4  95.25,96.52 0 top
U$5  15.88,99.06 180 top
U$10  95.25,2.54 0 top
U$11  95.25,53.34 0 top
U$12  17.78,71.75 315 top
U$19  3.81,53.34 0 top
U$20  95.25,45.72 0 top
U$42  3.81,45.72 0 top
U$56  5.08,60.64 90 top
X4  85.09,97.47 270 top

### Tracks (layer width: path | path; a pad name or v marks a point on that pad's centre or on a via)
A0  (via drill 0.36)
  Top 0.203: U$12.3 13.08,69.53 11.43,69.53 11.11,69.22 11.11,63.82 14.6,60.33 14.6,57.79 | Q2.1 14.6,57.79 | 14.6,57.79 15.43,57.79 C27.1 16.06,57.91 v16.83,57.15
  Bottom 0.203: v16.83,57.15 16.83,53.98 18.73,52.07 31.12,52.07 J11.1
A1
  Top 0.203: J4.3 39.37,54.29 38.1,55.56 26.04,55.56 24.45,53.98 19.69,53.98 18.73,54.93 18.73,58.1 13.34,63.5 13.34,66.96 U$12.7
A2
  Top 0.203: J4.4 41.91,54.61 40.32,56.2 25.4,56.2 23.81,54.61 20,54.61 19.37,55.24 19.37,58.42 13.97,63.82 13.97,66.88 U$12.8
A3
  Top 0.203: J4.5 44.45,54.93 42.23,57.15 25.08,57.15 23.18,55.24 20.32,55.24 20,55.56 20,58.74 14.6,64.14 14.6,66.81 U$12.9
A4
  Top 0.203: J4.6 46.99,55.88 44.45,58.42 21.27,58.42 15.24,64.45 15.24,66.74 U$12.10
A5  (via drill 0.36)
  Top 0.203: U$12.47 13.02,73.34 12.06,73.34 v11.75,73.03
  Bottom 0.203: v11.75,73.03 11.75,66.36 12.06,66.04 14.6,66.04 15.24,65.41 15.24,61.28 16.83,59.69 31.75,59.69 34.29,57.15 J4.1
ANT
  Top 0.203: X4.3 85.09,95.88 85.72,95.25 87.63,95.25 JP2.1 92.09,95.87 U4.1P U4.1
BACKLITLED  (via drill 0.36)
  Top 0.203: v53.02,79.22 61.12,79.22 62.23,79.06 62.52,79.06 LCD1.3 | R16.1 v80.33,53.34
  Bottom 0.203: v53.02,79.22 53.02,73.34 60.96,73.34 63.5,70.8 63.5,55.24 65.41,53.34 v80.33,53.34
CL1
  Top 0.203: 8.89,26.67 8.89,34.29 10.08,35.48 S1.3 11.15,35.84 8.89,38.1 8.89,45.72 10.16,46.99 33.02,46.99 J1.1 | 8.89,26.67 8.89,18.69 S3.3 10.08,16.43 8.26,14.6 8.26,9.09 S4.3 | S2.3 8.18,25.96 8.89,26.67
CL2
  Top 0.203: 16.51,25.4 16.51,34.29 17.7,35.48 S6.3 18.77,37.11 16.51,39.37 16.51,44.45 17.78,45.72 34.29,45.72 J1.2 | 16.51,25.4 16.51,18.69 S8.3 17.7,16.43 16.51,15.24 16.51,8.46 S9.3 | S7.3 15.95,25.96 16.51,25.4
CL3
  Top 0.203: 24.13,25.4 24.13,34.29 25.32,35.48 S11.3 26.39,37.11 24.13,39.37 24.13,43.18 25.4,44.45 35.56,44.45 J1.3 | 24.13,25.4 24.13,18.69 S13.3 | S12.3 23.57,25.96 24.13,25.4 | S13.3 26.75,16.43 | S13.3 25.32,16.43 24.13,15.24 24.13,8.46 S14.3
CL4
  Top 0.203: 31.75,25.4 31.75,34.29 32.94,35.48 S16.3 34.01,37.82 35.56,39.37 38.1,39.37 39.37,40.64 39.37,43.81 41.91,46.36 J1.4 | 31.75,25.4 31.75,18.69 S18.3 32.94,16.43 31.75,15.24 31.75,8.46 S19.3 | S17.3 31.19,25.96 31.75,25.4
CL5
  Top 0.203: 39.37,25.4 39.37,34.29 40.56,35.48 S21.3 41.63,37.82 43.18,39.37 43.18,44.45 44.45,45.72 J1.5 | 39.37,25.4 39.37,18.69 S23.3 41.2,16.43 39.37,14.6 39.37,8.46 S24.3 | S22.3 38.81,25.96 39.37,25.4
CL6
  Top 0.203: S26.3 48.18,35.48 | 48.18,35.48 46.99,34.29 46.99,25.4 | 46.99,25.4 46.99,18.69 S28.3 | S27.3 46.43,25.96 46.99,25.4 | S28.3 49.61,16.43 | 48.18,35.48 48.18,38.18 46.99,39.37 J1.6 | S28.3 48.18,16.43 46.99,15.24 46.99,8.46 S29.3
CL7
  Top 0.203: S31.3 55.8,35.48 | 55.8,35.48 54.61,34.29 54.61,25.4 | 54.61,25.4 54.61,18.69 S33.3 | S32.3 54.05,25.96 54.61,25.4 | S33.3 57.23,16.43 | 55.8,35.48 55.8,38.18 54.61,39.37 52.07,39.37 50.8,40.64 50.8,44.45 49.53,45.72 J1.7 | S33.3 55.8,16.43 54.61,15.24 54.61,8.46 S34.3
CL8
  Top 0.203: S36.3 63.42,35.48 | 63.42,35.48 62.23,34.29 62.23,25.4 | 62.23,25.4 62.23,18.69 S38.3 | S37.3 61.67,25.96 62.23,25.4 | S38.3 64.85,16.43 | 63.42,35.48 63.42,36.91 62.23,38.1 57.15,38.1 54.61,40.64 54.61,43.18 52.07,45.72 J1.8 | S38.3 64.06,16.43 62.87,15.24 62.87,9.09 S39.3
CL9
  Top 0.203: S41.3 71.04,35.48 69.85,34.29 | 69.85,34.29 69.85,25.4 | 69.85,25.4 69.85,18.69 S43.3 72.11,9.45 S44.3 | S42.3 69.29,25.96 69.85,25.4 | 69.85,34.29 69.85,36.83 68.58,38.1 64.77,38.1 63.5,39.37 59.69,39.37 58.42,40.64 58.42,43.18 54.61,46.99 J1.9
CL10
  Top 0.203: S46.3 79.73,29.77 S47.3 75.92,25.68 78.74,22.86 78.74,18.69 S48.3 | S46.3 79.73,35.84 76.2,39.37 64.77,39.37 62.23,41.91 62.23,43.81 60.96,45.09 59.05,45.09 57.15,46.99 J1.10 | S49.3 85.92,41.67 S46.3
CL11
  Top 0.203: S51.3 82.27,6.63 83.82,5.08 89.53,5.08 | 89.53,5.08 95.68,5.08 S53.3 95.25,9.17 95.25,15.24 94.06,16.43 | S52.3 89.89,5.44 89.53,5.08 | S54.3 94.06,16.43 | 94.06,16.43 94.06,16.59 95.25,17.78 95.25,41.91 92.08,45.09 62.87,45.09 J1.11
D0
  Top 0.203: U$12.16 21.27,66.5 21.27,61.91 22.86,60.33 50.16,60.33 54.61,55.88 J4.9
D1
  Top 0.203: U$12.15 19,68 20.64,66.36 20.64,61.59 22.54,59.69 48.26,59.69 52.07,55.88 J4.8
D2  (via drill 0.36)
  Top 0.203: v57.15,70.17 56.52,70.8 24.77,70.8 24.45,70.48 22.23,70.48 U$12.23
  Bottom 0.203: J4.11 59.69,64.77 57.15,67.31 v57.15,70.17
D3_IRQ  (via drill 0.36)
  Top 0.203: U4.6P 82.09,79.06 | 82.09,79.06 U4.6 | J10.6 69.85,93.98 81.91,81.91 81.91,79.23 82.09,79.06 | U$12.14 20,66.35 20,63.18 v19.37,63.18
  Bottom 0.203: v19.37,63.18 34.61,63.18 53.34,81.91 81.28,81.91 81.91,81.28 81.91,78.73 U4.6
D4_RST  (via drill 0.36)
  Top 0.203: v26.04,64.45 27.94,66.67 73.66,66.67 73.66,56.52 87.95,56.52 88.09,56.66 U4.14P U4.14 88.27,65.13 88.27,72.39 85.41,75.25 78.11,75.25 76.2,77.15 76.2,79.38 67.31,88.27 J10.5 | v19.05,65.09 18.73,65.09 18.41,65.41 18.41,66.36 18.73,66.67 18.73,66.91 U$12.13
  Bottom 0.203: v26.04,64.45 25.4,65.09 v19.05,65.09
D5  (via drill 0.36)
  Top 0.203: v59.69,70.17 59.69,70.8 59.05,71.44 24.13,71.44 23.81,71.12 22.3,71.12 U$12.24
  Bottom 0.203: J5.1 62.23,65.72 59.69,68.26 v59.69,70.17
D6  (via drill 0.36)
  Top 0.203: U$12.29 23.05,75.97 42.55,75.97 v43.81,75.97 LCD1.7
  Bottom 0.203: TFT-LCD.4 46.99,82.23 43.5,78.74 43.5,76.28 v43.81,75.97
D7
  Top 0.203: U$12.30 23.14,76.77 49.53,76.77 | 49.53,76.77 LCD1.6 | TFT-LCD.3 49.53,76.77
D8_CS  (via drill 0.36)
  Top 0.203: v24.45,61.28 24.45,64.45 27.3,67.31 74.3,67.31 74.3,57.15 85.72,57.15 85.72,62.23 86.09,62.59 U4.13P U4.13 86.04,65 86.04,72.39 83.82,74.61 77.79,74.61 75.56,76.84 75.56,79.06 64.77,89.85 J10.4 | v16.19,65.09 16.19,66.99 U$12.11
  Bottom 0.203: v24.45,61.28 23.81,60.64 16.83,60.64 16.19,61.28 v16.19,65.09
D9
  Top 0.203: J4.7 49.53,55.88 46.36,59.05 21.91,59.05 17.15,63.82 17.15,66.04 16.83,66.36 16.83,66.91 U$12.12
D10  (via drill 0.36)
  Top 0.203: U$12.27 22.87,74.36 41.27,74.36 | 41.27,74.36 LCD1.9 | v41.27,73.66 41.27,74.36
  Bottom 0.203: TFT-LCD.6 41.91,80.01 41.27,79.38 v41.27,73.66
D11  (via drill 0.36)
  Top 0.203: U$12.25 22.94,73.03 29.84,73.03 30.91,71.97 38.1,71.97 v38.73,72.6 | v38.73,72.6 38.73,72.55 39.21,72.07 39.37,72.07 | 39.37,72.07 60.48,72.07 60.59,71.97 LCD1.12 | v38.73,72.6 38.84,72.6 39.37,72.07
  Bottom 0.203: TFT-LCD.7 39.37,73.23 v38.73,72.6
D12  (via drill 0.36)
  Top 0.203: U$12.28 22.96,75.16 41.59,75.16 v42.23,75.16 LCD1.8
  Bottom 0.203: TFT-LCD.5 44.45,80.96 42.23,78.74 v42.23,75.16
D13  (via drill 0.36)
  Top 0.203: Q1.1 88.27,52.39 87.31,51.44 72.39,51.44 72.39,64.77 32.39,64.77 32.07,64.45 v31.43,64.45 | U$12.26 22.87,73.66 30.8,73.66 v31.43,73.03 v36.51,73.03
  Bottom 0.203: v31.43,64.45 v31.43,73.03 | TFT-LCD.8 36.83,73.34 v36.51,73.03
D42
  Top 0.203: J4.2 36.83,54.29 36.2,54.93 26.35,54.93 24.77,53.34 19.37,53.34 18.1,54.61 18.1,57.78 11.75,64.14 11.75,68.58 12.06,68.9 13.16,68.9 U$12.4
D+
  Top 0.203: U$12.34 22.23,78.67 22.23,78.74 24.13,80.64 24.13,88.58 15.88,88.58 U$5.P3
D-
  Top 0.203: U$12.33 22.86,78.6 22.86,78.74 24.77,80.64 24.77,89.22 16.51,89.22 16.51,89.2 16.52,89.2 U$5.P2
DIO1
  Top 0.203: U4.7P U4.7
DIO2
  Top 0.203: U4.8P U4.8 78.09,76.22 78.42,75.88 87,75.88 88.58,74.3 JP5.3
DIO3
  Top 0.203: U4.3P U4.3 88.27,78.38 88.27,77.15 89.85,75.56 96.84,75.56 97.47,74.93 97.47,72.39 96.84,71.75 JP5.2
DIO5
  Top 0.203: U4.15P U4.15 90.17,65.03 90.17,67.31 92.08,69.22 JP5.1
GND  (via drill 0.36)  (1 unrouted)
  Top 0.203: C19.2 24.03,66.78 23.5,67.31 21.87,67.31 U$12.18 17.78,71.4 U$12.THERMAL | U$12.35 17.78,74.93 U$12.THERMAL | U$12.THERMAL 16.83,72.71 16.83,73.03 15.5,74.35 U$12.42 11.78,78.11 C16.2 11.01,78.84 10.64,79.22 | U$12.THERMAL 16.72,71.75 U$12.5 | 10.64,79.22 10.48,79.38 8.89,79.38 | 8.89,79.38 7.3,79.38 7.3,78.11 | 7.3,78.11 7.3,75.89 C20.2 | 18.1,82.23 C4.2 17.78,81.91 16.83,81.91 15.88,80.96 15.24,80.96 14.29,80.01 3V3.1 13.7,79.96 13.34,80.33 11.75,80.33 10.64,79.22 | 18.1,82.23 19.59,81.91 C7.2 | LCD1.5 67.94,77.56 | 67.94,77.56 67.94,80.01 62.63,80.01 | 62.63,80.01 LCD1.2 | 67.94,77.56 67.94,71.44 | 67.94,71.44 67.94,71.12 62.63,71.12 LCD1.13 | U4.16 91.91,63.05 91.91,58.1 90.81,56.83 Q1.2 | 19.36,95.89 19.47,96.01 U$5.GND7 U$5.GND1 U$5.GND2 | 19.36,95.89 U$5.GND3 | U$5.GND2 U$5.GND8 13.38,96.51 U$5.GND4 13.35,94.93 12.06,94.93 11.43,94.3 C13.2 10.8,92.08 6.98,92.08 6.67,92.39 U3.2 6.67,94.3 6.35,94.61 5.72,94.61 5.08,93.98 3.17,93.98 1.59,92.39 J8.1 | U$5.GND2 14.58,97.31 U$5.P5 14.6,94.88 14.6,88.58 | 18.1,82.23 18.1,87.95 14.6,87.95 14.6,88.58 | 7.3,78.11 JTAG.1 1.59,78.11 0.95,77.47 0.95,71.75 1.59,71.12 C18.2 C17.2 v5.72,66.04 | Q2.2 12.7,59.69 10.16,59.69 10.16,66.04 v5.72,66.04 | v5.72,66.04 arc-146 5.64,65.97 arc270 v5.72,66.04 | U4.2P U4.2 | U4.9P 78.11,63.67 78.11,64.95 U4.9 78.09,70.18 77.15,71.12 68.26,71.12 67.94,71.44 | U4.16 U4.16P | LED13X1.K 14.6,51.44 9.84,51.44 9.21,52.07 LED13X.K 8.89,52.7 7.3,53.66 7.3,54.29 3.49,58.1 3.49,63.82 v5.72,66.04 | 62.63,80.01 54.61,80.01 TFT-LCD.1 | U4.2 90.17,78.47 90.17,76.52 90.49,76.2 97.47,76.2 98.11,75.56 98.11,68.58 95.57,66.04 93.17,66.04 U4.16
  Top 0.203: U4.2 90.17,78.64 90.17,82.87 88.27,84.77 BT3.CON(-) 83.72,85.37 80.37,85.37 75.56,90.17 75.56,95.25 76.2,95.88 83.19,95.88 83.82,96.52 X4.2 | J7.2 29.21,95.25 28.26,94.3 20.96,94.3 19.36,95.89 | C6.2 8.89,79.38 | R3.2 9.31,86.14 11.75,88.58 14.6,88.58
  Top 0.305: 19.65,97.79 U$5.GND7
  Bottom 0.203: S5.2 6.35,66.46 arc-45 6.28,66.28 v5.72,66.04
  Bottom 0.813: BT3.CON(-) 81.28,84.77 77.47,88.58 56.52,88.58 54.93,90.17 | 54.93,90.17 54.61,90.49 TFT-LCD.1 | 54.93,90.17 54.93,85.09 40.01,70.17 36.51,70.17 34.92,71.75 34.92,88.58 29.21,94.3 J7.2
  pour Bottom (isolate 1.422, hatched): 99.06,99.06 0,99.06 0,50.8 99.06,50.8
  pour Top (isolate 1.422, hatched): 0,99.06 99.06,99.06 99.06,50.8 0,50.8
LIN
  Top 0.203: J6.1 7.24,64.07 arc-45 7.41,64.14 U$56.- arc45 8.57,64.12 8.57,58.74 Q2.3 10.97,57.62 12.06,56.52 15.43,56.52 C27.2
MISO
  Top 0.203: U$12.21 22.09,69.22 76.2,69.22 76.2,61.59 79.69,61.59 80.09,61.99 U4.10P U4.10 80.33,65.19 80.33,71.75 79.38,72.71 76.84,72.71 73.66,75.88 73.66,78.11 57.15,94.61 J10.1
MOSI  (via drill 0.36)
  Top 0.203: U$12.19 21.94,67.94 74.93,67.94 74.93,57.78 81.91,57.78 v81.91,59.69 | U4.11P U4.11 82.23,65.1 82.23,72.07 80.96,73.34 77.15,73.34 74.3,76.2 74.3,78.42 59.69,93.03 J10.2
  Bottom 0.203: v81.91,59.69 82.09,60.15 U4.11
N$1
  Top 0.203: J9.4 J9.3 6.04,82.55 C6.1 14.76,82.55 3V3.3
N$2
  pour Top (isolate 1.422, hatched): 0,48.26 99.06,48.58 99.06,0 0,0
  pour Bottom (isolate 1.422, hatched): 99.06,48.26 0,48.26 0,0 99.06,0
N$3  (via drill 0.36)
  Top 0.203: v8.89,96.2 8.89,97.37 R2.1
  Bottom 0.203: CHG.C 13.97,97.16 13.02,96.2 v8.89,96.2
N$5
  Top 0.203: U3.1 7.62,95.25 6.98,95.88 6.98,97.37 R2.2
N$6
  Top 0.203: R3.1 7.62,89.51 U3.5
N$7
  Top 0.203: LED13X1.A 15.88,54.61 15.88,52.39 R8.2
N$8
  Top 0.203: U$12.2 13.01,70.17 10.8,70.17 10.48,69.85 10.48,69.22 10.07,68.81 32,768KHZ1.4 8.26,67.31 C17.1
N$9
  Top 0.203: U$12.1 12.94,70.8 10.16,70.8 9.84,70.48 9.84,69.93 9.63,69.72 32,768KHZ1.1 8.26,71.12 C18.1
N$10  (14 unrouted)
  Bottom 0.406: 34.29,50.8 34.29,48.89 | 36.83,50.8 36.83,48.89 | 39.37,50.8 39.37,48.89 | 41.91,50.8 41.91,48.89 | 44.45,50.8 44.45,48.89 | 46.99,50.8 46.99,48.89 | 49.53,50.8 49.53,48.89 | 52.07,50.8 52.07,48.89 | 54.61,50.8 54.61,48.89 | 57.15,50.8 57.15,48.89 | 59.69,50.8 59.69,48.89 | 62.23,50.8 62.23,48.89 | 64.77,50.8 64.77,48.89 | 67.31,50.8 67.31,48.89 | 69.85,50.8 69.85,48.89
N$11
  Top 0.203: Q1.3 R16.2
N$22
  Top 0.203: LED13X.A 9.21,54.61 10.8,52.7 11.62,52.7 R7.2
PA13  (via drill 0.36)
  Top 0.203: v54.29,70.01 53.98,70.01 53.82,70.17 25.4,70.17 25.08,69.85 22.16,69.85 U$12.22
  Bottom 0.203: J4.10 57.15,64.14 54.61,66.67 54.61,69.69 v54.29,70.01
PA28  (via drill 0.36)
  Top 0.203: J5.4 69.85,62.23 67.94,64.14 65.41,64.14 63.5,62.23 30.16,62.23 v30.16,64.45 | v12.38,79.38 12.38,78.21 U$12.41
  Bottom 0.203: v30.16,64.45 30.16,78.42 29.21,79.38 v12.38,79.38
PB22  (via drill 0.36)
  Top 0.203: J5.2 64.77,59.69 63.5,60.96 27.62,60.96 v27.62,64.45 | v17.78,77.79 16.83,76.84 16.83,76.6 U$12.37
  Bottom 0.203: v27.62,64.45 27.62,77.15 26.67,78.11 18.1,78.11 v17.78,77.79
PB23  (via drill 0.36)
  Top 0.203: J5.3 67.31,60.33 66.04,61.59 28.89,61.59 v28.89,64.45 | v16.51,77.79 16.19,77.47 16.19,76.52 16.5,76.21 16.51,76.21 U$12.38
  Bottom 0.203: v28.89,64.45 28.89,78.11 28.26,78.74 16.51,78.74 v16.51,77.79
RESET  (via drill 0.36)
  Top 0.203: v13.97,77.79 13.97,77.33 U$12.40
  Bottom 0.203: JTAG.3 6.35,75.56 | 6.35,75.56 10.16,75.56 11.43,76.84 13.97,76.84 v13.97,77.79 | S5.1 6.35,75.56
RV1
  Top 0.203: S51.1 77.55,6.91 74.3,10.16 74.3,24.77 73.66,25.4 73.66,33.93 S46.1
  Bottom 0.203: S1.1 6.63,35.84 8.89,38.1 13.97,38.1 | 13.97,38.1 21.59,38.1 | 21.59,38.1 29.21,38.1 | 29.21,38.1 36.83,38.1 | 36.83,38.1 44.45,38.1 | 44.45,38.1 52.07,38.1 | 52.07,38.1 59.69,38.1 | 59.69,38.1 67.31,38.1 | 67.31,38.1 74.93,38.1 75.21,37.82 S46.1 | S41.1 67.59,37.82 67.31,38.1 | S36.1 59.97,37.82 59.69,38.1 | S31.1 52.35,37.82 52.07,38.1 | S26.1 44.73,37.82 44.45,38.1 | S21.1 37.11,37.82 36.83,38.1 | S16.1 29.49,37.82 29.21,38.1 | S11.1 21.87,37.82 21.59,38.1 | S6.1 14.25,37.82 13.97,38.1 | 59.69,38.1 59.69,39.37 58.42,40.64 58.42,44.45 59.05,45.09 61.59,45.09 62.23,45.72 J2.1
RV2  (via drill 0.36)
  Top 0.203: S52.1 85.37,7.9 87.63,10.16 v87.63,31.75
  Bottom 0.203: S2.1 2.82,26.95 5.08,29.21 10.16,29.21 | 10.16,29.21 17.78,29.21 | 17.78,29.21 25.4,29.21 | 25.4,29.21 33.02,29.21 | 33.02,29.21 40.64,29.21 | 40.64,29.21 48.26,29.21 | 48.26,29.21 55.88,29.21 | 55.88,29.21 63.5,29.21 | 63.5,29.21 69.85,29.21 71.12,27.94 | 71.12,27.94 71.12,26.24 S47.1 | S42.1 63.78,28.93 63.5,29.21 | S37.1 56.16,28.93 55.88,29.21 | S32.1 48.54,28.93 48.26,29.21 | S27.1 40.92,28.93 40.64,29.21 | S22.1 33.3,28.93 33.02,29.21 | S17.1 25.68,28.93 25.4,29.21 | S12.1 18.06,28.93 17.78,29.21 | S7.1 10.44,28.93 10.16,29.21 | J2.2 64.77,45.19 arc45 64.84,45.01 65.72,44.13 76.09,44.13 arc-45 76.27,44.06 77.47,42.86 77.47,41.06 arc45 77.54,40.88 79.06,39.37 90.7,39.37 arc-45 90.88,39.3 92.71,37.47 93.66,37.47 94.62,36.51 94.62,33.44 arc-45 94.54,33.26 93.03,31.75 88.9,31.75 v87.63,31.75 79.16,31.75 arc45 78.98,31.68 76.2,28.89 72.18,28.89 arc45 72,28.82 71.12,27.94
RV3
  Bottom 0.203: 76.2,19.05 83.19,19.05 83.19,26.99 86.68,30.48 92.71,30.48 93.66,31.43 | 76.2,19.05 67.31,19.05 | 67.31,19.05 59.69,19.05 | 59.69,19.05 52.07,19.05 | 52.07,19.05 44.45,19.05 | 44.45,19.05 36.83,19.05 | 36.83,19.05 29.21,19.05 | 29.21,19.05 21.59,19.05 | 21.59,19.05 13.97,19.05 | 13.97,19.05 9.25,19.05 S3.1 | S8.1 14.25,18.77 13.97,19.05 | S13.1 21.87,18.77 21.59,19.05 | S18.1 29.49,18.77 29.21,19.05 | S23.1 37.11,18.77 36.83,19.05 | S28.1 44.73,18.77 44.45,19.05 | S33.1 52.35,18.77 52.07,19.05 | S38.1 59.97,18.77 59.69,19.05 | S43.1 67.59,18.77 67.31,19.05 | S48.1 76.48,18.77 76.2,19.05 | J2.3 67.31,45.4 67.94,44.77 79.69,44.77 81.6,42.86 81.6,40.32 81.91,40 91.12,40 93.03,38.1 93.98,38.1 95.25,36.83 95.25,33.02 93.66,31.43 | S53.1 92.99,7.9 95.25,10.16 95.25,29.84 93.66,31.43
RV4
  Top 0.203: S4.1 1.55,6.71 3.17,5.08 10.16,5.08 | 10.16,5.08 17.15,5.08 | 17.15,5.08 24.77,5.08 | 24.77,5.08 33.02,5.08 | 33.02,5.08 40.64,5.08 | 40.64,5.08 48.26,5.08 | 48.26,5.08 55.88,5.08 | 55.88,5.08 63.22,5.08 S44.1 66.88,5.08 79.38,5.08 80.01,5.72 80.01,8.89 80.64,9.52 83.19,9.52 83.82,10.16 83.82,14.6 85.37,16.15 S54.1 | S39.1 56.16,5.36 55.88,5.08 | S34.1 48.54,5.36 48.26,5.08 | S29.1 40.92,5.36 40.64,5.08 | S24.1 33.3,5.36 33.02,5.08 | S19.1 25.68,5.99 24.77,5.08 | S14.1 18.06,5.99 17.15,5.08 | S9.1 10.44,5.36 10.16,5.08
  Bottom 0.203: J2.4 69.85,45.72 70.17,45.4 80.33,45.4 82.23,43.5 82.23,40.96 82.55,40.64 91.44,40.64 93.34,38.73 94.58,38.73 95.23,39.39 | 95.23,39.39 S49.1 | S54.1 86.44,16.43 87.63,15.24 87.63,6.35 88.9,5.08 93.34,5.08 95.88,7.62 95.88,38.73 95.23,39.39
RXLED  (via drill 0.36)
  Top 0.203: R7.1 11.11,55.24 v11.11,55.88 | v9.84,72.07 12.06,72.07 12.7,72.71 12.94,72.71 U$12.48
  Bottom 0.203: v11.11,55.88 13.97,55.88 13.97,64.45 13.34,65.09 11.43,65.09 10.8,65.72 10.8,71.12 v9.84,72.07
SCK
  Top 0.203: U$12.20 22.02,68.58 75.56,68.58 75.56,60.96 80.64,60.96 81.28,61.59 83.5,61.59 84.09,62.18 U4.12P U4.12 84.14,65 84.14,72.07 82.23,73.98 77.47,73.98 74.93,76.52 74.93,78.74 62.23,91.44 J10.3
SCL
  Top 0.203: U$12.32 24.45,79.48 24.45,79.69 25.4,80.64 25.4,88.9 27.62,91.12 31.75,91.12 J7.3
SDA
  Top 0.203: U$12.31 25.4,79.73 25.4,79.69 26.04,80.33 26.04,88.58 27.62,90.17 34.29,90.17 J7.4
SWC
  Top 0.203: U$12.45 13.16,74.61 10.8,74.61 10.16,73.98 3.17,73.98 2.86,74.3 JTAG.4
SWD
  Top 0.203: U$12.46 13.08,73.98 11.11,73.98 10.48,73.34 3.17,73.34 2.86,73.03 JTAG.5
TXLED  (via drill 0.36)
  Top 0.203: U$12.39 16.56,75.52 15.24,76.84 v15.24,77.79 | v40.32,65.72 v33.34,65.72 | v35.56,53.98 26.35,53.98 25.08,52.7 18.29,52.7 R8.1
  Bottom 0.203: v15.24,77.79 15.24,78.74 13.02,78.74 12.38,78.11 11.11,78.11 10.8,78.42 10.8,80.64 13.34,80.64 13.97,80.01 30.48,80.01 33.34,77.15 v33.34,65.72 | v40.32,65.72 40.32,53.98 v35.56,53.98
VBAT
  Top 0.203: C13.1 9.21,90.81 8.57,91.44 6.03,91.44 5.72,91.75 U3.3 5.69,93.03 3.81,93.03 3.17,92.39 3.17,89.85 2.22,88.9 J8.2 1.59,87 J9.6 J9.5 6.03,86.04 7.3,84.77 BT3.CON(+)
VBUS  (via drill 0.36)
  Top 0.203: U3.4 4.42,91.76 v4.13,91.76 | v17.78,92.08 17.15,92.08 17.15,94.88 U$5.P1 | J9.2 J9.1
  Bottom 0.203: CHG.A 16.83,96.84 16.83,92.08 | v17.78,92.08 16.83,92.08 | 16.83,92.08 6.98,92.08 | 6.98,92.08 4.45,92.08 v4.13,91.76 | J9.1 6.67,80.96 7.3,81.6 7.3,91.76 6.98,92.08
VCC  (via drill 0.36)
  Top 0.203: U$12.44 12.96,75.51 | 12.96,75.51 12.7,75.56 v12.38,75.56 | v12.38,75.56 10.69,75.56 C20.1 10.48,75.25 9.84,74.61 4.76,74.61 2.54,76.84 JTAG.2 | U$12.17 21.69,66.78 C19.1 22.33,62.13 v22.54,61.91 | 3V3.2 17.73,79.96 C4.1 17.88,80.11 19.05,79.48 | 19.05,79.48 C7.1 20.54,79.69 21.27,79.69 22.23,80.64 v22.23,81.28 | 19.05,79.48 19.05,76.91 | 19.05,76.91 U$12.36 | LCD1.4 52.07,78.36 | 52.07,78.36 v50.8,78.36 | LCD1.11 59.69,72.77 59.69,73.03 | 59.69,73.03 59.69,73.66 62.63,73.66 LCD1.10 | 59.69,73.03 v50.8,73.03 | v12.7,67.94 13.62,67.94 U$12.6 | v12.38,75.56 | v12.38,75.56 12.96,75.51 | 19.05,76.91 19.13,76.91 v19.37,77.15 | U4.5P U4.5 | TFT-LCD.2 52.07,78.36 | U$56.+ 7.41,57.14 arc-45 7.24,57.22 J6.2
  Bottom 0.203: v19.37,77.15 18.41,77.15 17.15,75.88 12.7,75.88 v12.38,75.56 12.7,75.25 v12.7,67.94 12.7,66.67 15.88,66.67 17.46,65.09 17.46,62.23 17.78,61.91 v22.54,61.91 22.86,61.91 23.18,62.23 25.56,62.23 25.88,61.91 34.61,61.91 45.72,73.03 v50.8,73.03 v50.8,78.36 50.8,78.42 53.34,80.96 72.71,80.96 76.52,77.15 82.69,77.15 U4.5 | J7.1 26.67,84.14 23.81,81.28 v22.23,81.28 | J6.2 2.22,59.37 0.95,60.64 0.95,76.2 1.59,76.84 JTAG.2
VDDCORE1
  Top 0.203: U$12.43 12.03,77.15 9.52,77.15 9.31,77.37 C16.1

### Text on the board
Top: ARMACHAT | Bobricius / 2020 | www.PeMi.Technology - Factory For Materializing Dreams
tNames: ANTENNA | 1K | I2C | TFT | RFM98 | GND | 10uF | +BAT | 1K | USB - Battery | 10uF | 100n | 10uF | 1uF | 10uF | JTAG | 22p | 32768KHz | ATSAMD21G18 | 22p | 100n | SPEAKER | RFM95 / LORA | DOOMSDAY COMMUNICATOR | 1K | 1K | KEYBOARD | RX | TX | 10R | 1! | 2@ | 3# | 4$ | 5% | 6^ | 7& | 8* | 9( | 0) | DEL | Q | W | E | R | T | Y | U | I | O | P | BKSP | A | S | D | F | G | H | J | K | L | ENTER | > | SHIFT | Z | X | C | V | B | N | M | SPACE | < | < | >
bNames: + | CHARGE | VCC | GND | SCL | SDA | D13 | D11 | D10 | D12 | D6 | D7 | VCC | GND | MISO | MOSI | SCK | D8 CS | D4 RST | D3 IRQ | RESET | www.PeMi.Technology / Factory For Materializing Dreams | A0 | A5 | D42 | A1 | A2 | A3 | A4 | D9 | D1 | D0 | PA13 | D2 | D5 | PB22 | PB23 | PA28
tStop: www.PeMi.Technology - Factory For Materializing Dreams